# EAGLE design xio (EAGLE 9.5.0)

## Sheet 1 of 12: Block diagram
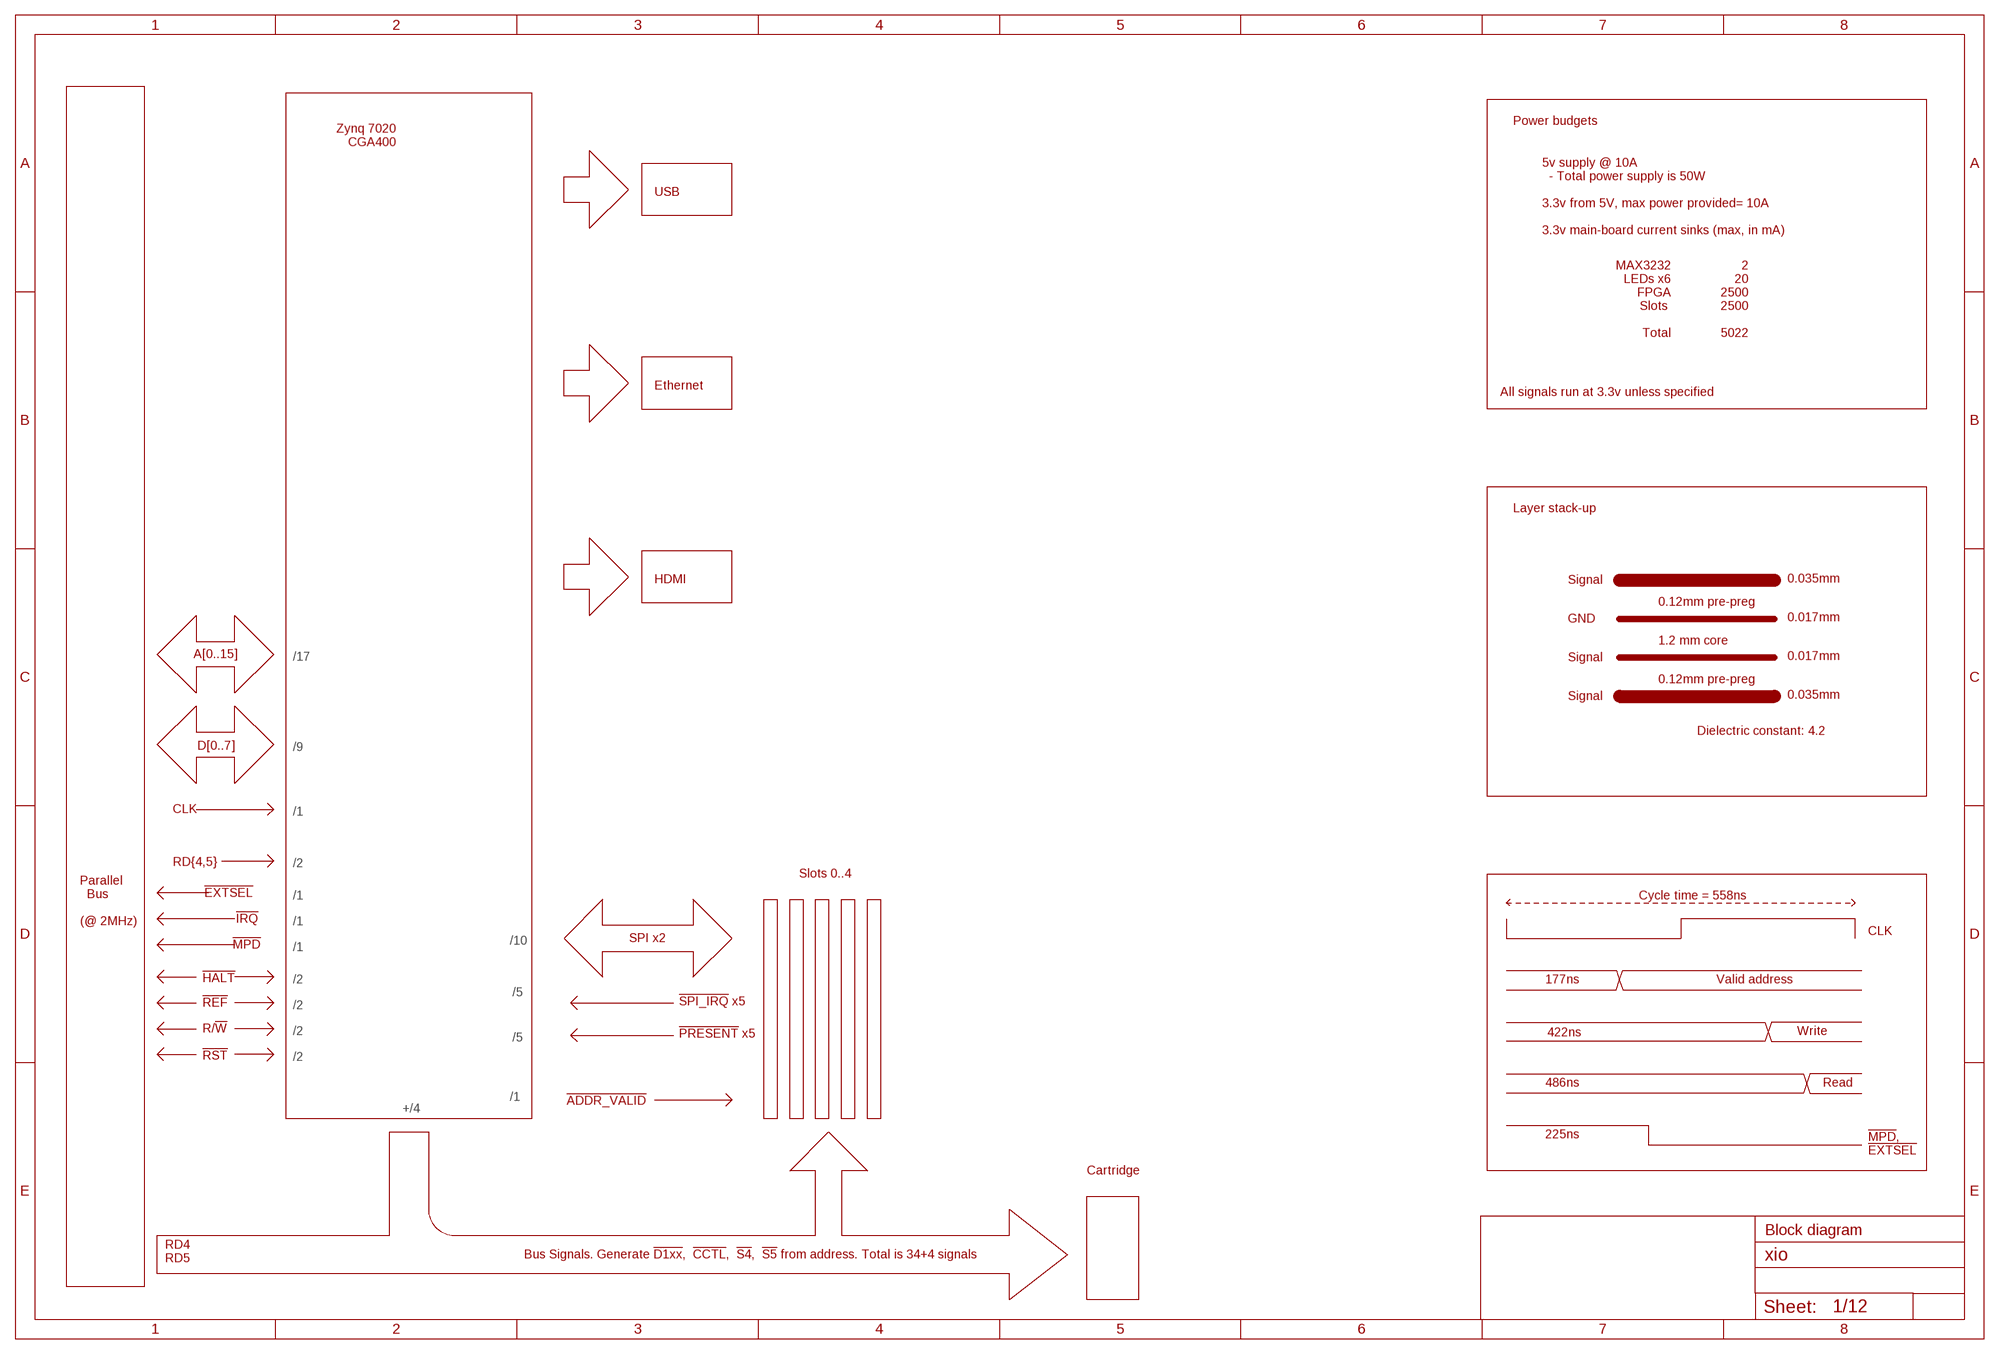
[diagram p0: schematic, sheet 1]

### Notes on the sheet
- Zynq 7020
   CGA400
- Power budgets
- USB
- 5v supply @ 10A
    - Total power supply is 50W
  
  3.3v from 5V, max power provided= 10A 
  
  3.3v main-board current sinks (max, in mA)
- MAX3232
  LEDs x6
  FPGA
  Slots 
  
  Total
- 2
  20
  2500
  2500
  
  5022
- Ethernet
- All signals run at 3.3v unless specified
- Layer stack-up
- HDMI | Signal | 0.035mm
- 0.12mm pre-preg
- GND | 0.017mm
- 1.2 mm core
- A[0..15] | /17 | Signal | 0.017mm
- 0.12mm pre-preg
- Signal | 0.035mm
- Dielectric constant: 4.2
- D[0..7] | /9
- CLK | /1
- RD{4,5} | /2
- Slots 0..4
- !EXTSEL!
- /1 | Cycle time = 558ns
- !IRQ!
- Parallel
    Bus
  
  (@ 2MHz)
- /1
- CLK
- !MPD! | SPI x2
- /10
- /1
- !HALT! | /2 | 177ns | Valid address
- /5
- !REF! | !SPI_IRQ! x5
- /2
- R/!W! | /2 | Write
- !PRESENT! x5 | 422ns
- /5
- !RST! | /2
- 486ns | Read
- /1
- !ADDR_VALID!
- +/4
- 225ns
- !MPD!,
  !EXTSEL!
- Cartridge
- Block diagram
- Bus Signals. Generate !D1xx!,  !CCTL!,  !S4!,  !S5! from address. Total is 34+4 signals
- RD4
  RD5

## Sheet 2 of 12: High voltage signalling
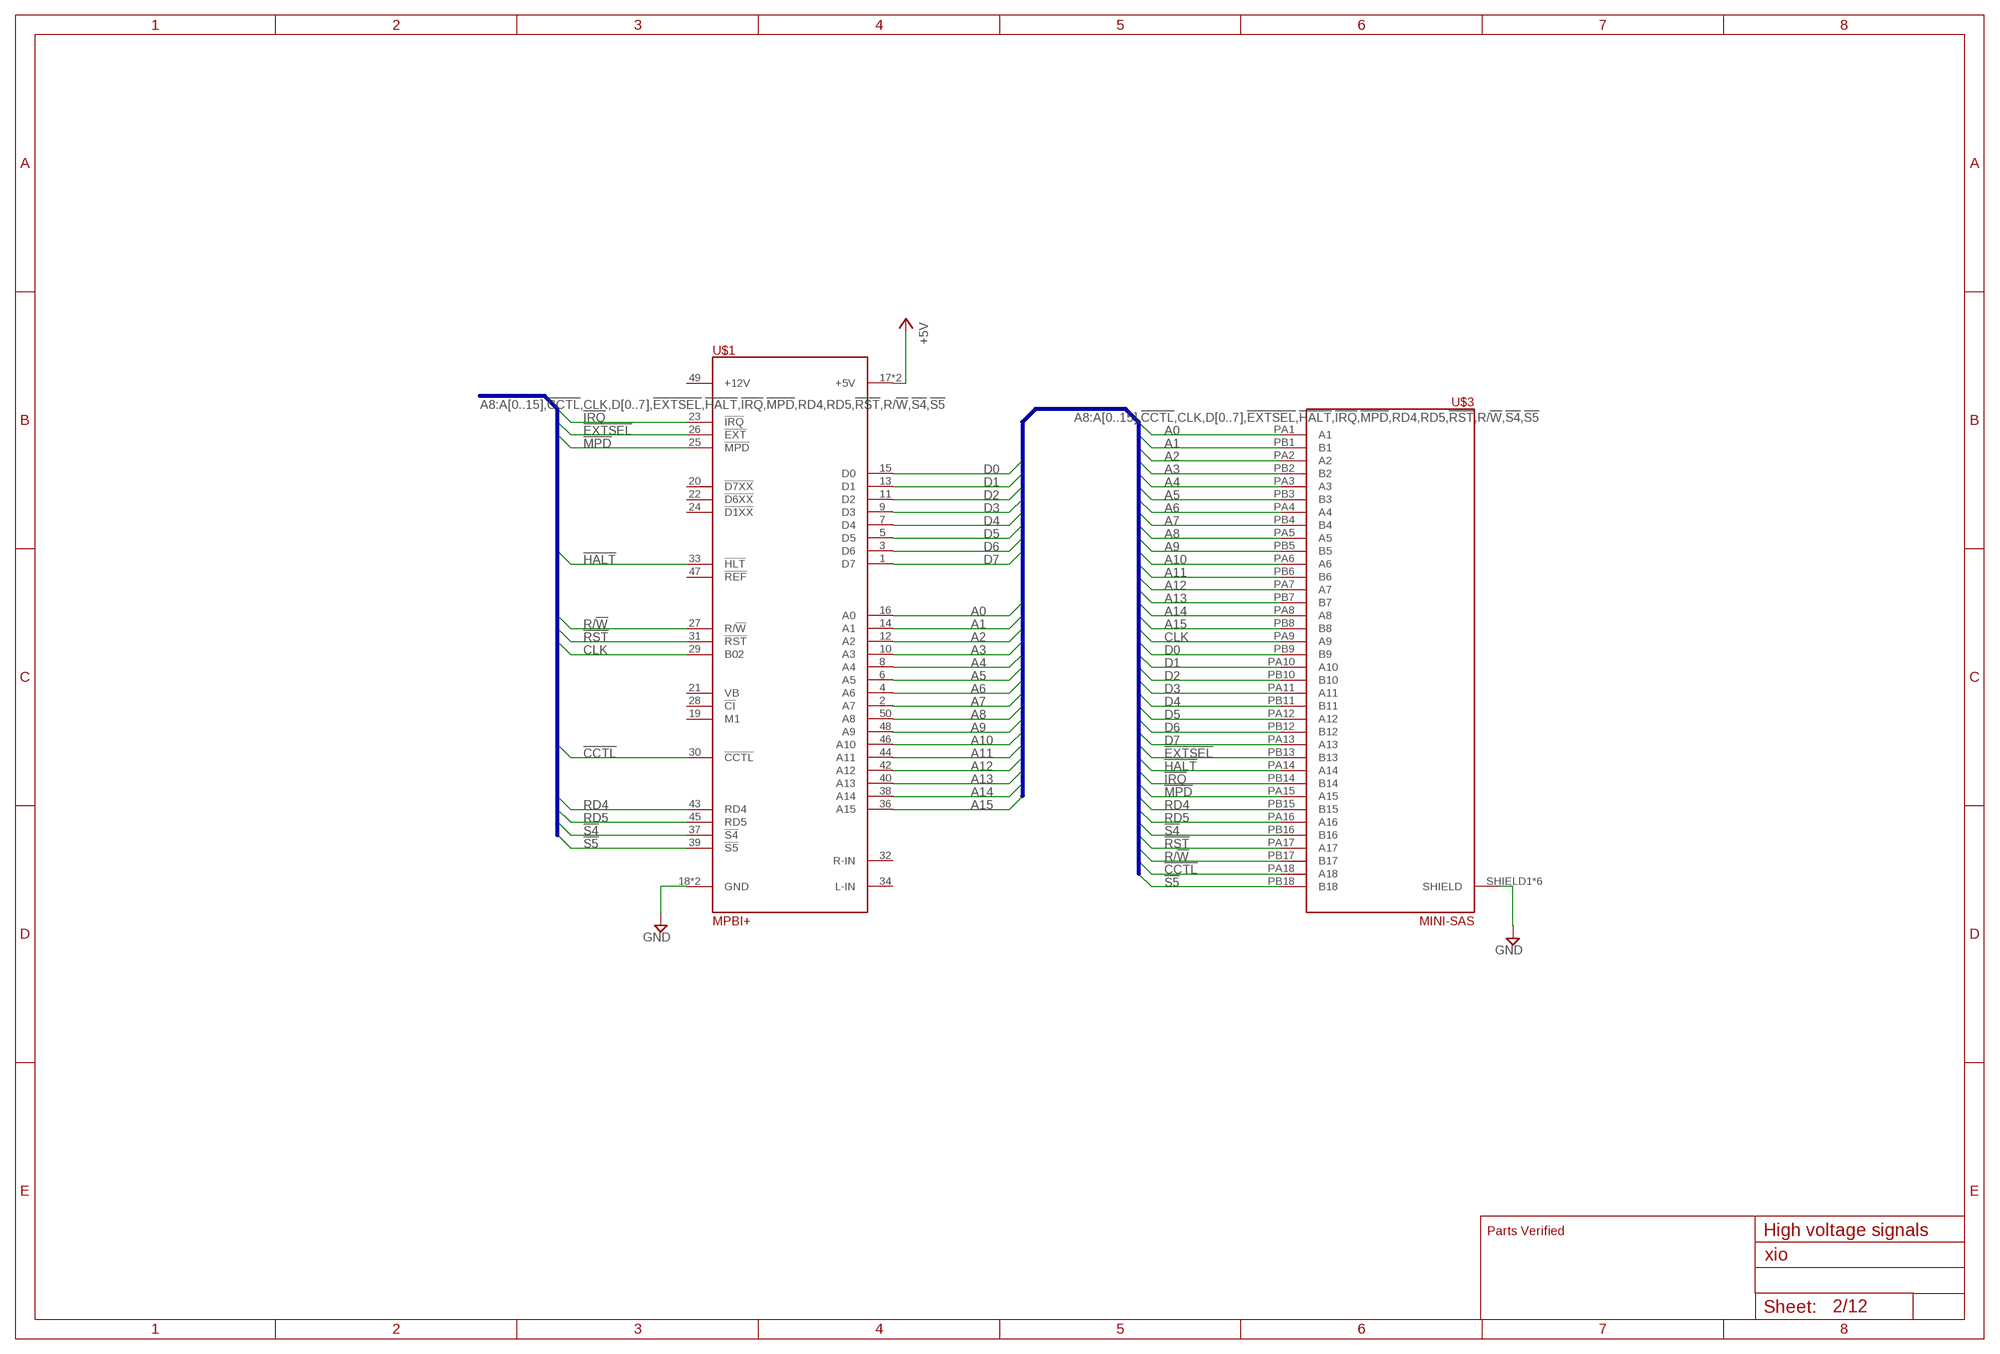
[diagram p1: schematic, sheet 2]

### Parts
U$1  MPBI+  [2X25]
U$3  MINI-SAS  [MINI-SAS]

### Nets
!CCTL!: U$1.30(!CCTL!) U$3.PA18(A18)
!EXTSEL!: U$1.26(!EXT!) U$3.PB13(B13)
!HALT!: U$1.33(!HLT!) U$3.PA14(A14)
!IRQ!: U$1.23(!IRQ!) U$3.PB14(B14)
!MPD!: U$1.25(!MPD!) U$3.PA15(A15)
!RST!: U$1.31(!RST!) U$3.PA17(A17)
!S4!: U$1.37(!S4!) U$3.PB16(B16)
!S5!: U$1.39(!S5!) U$3.PB18(B18)
+5V [Power]: U$1.17(+5V) U$1.41(+5V) ; also sheet 3,4,5
A0: U$1.16(A0) U$3.PA1(A1) ; also sheet 3,4,5
A1: U$1.14(A1) U$3.PB1(B1) ; also sheet 3,4,5
A2: U$1.12(A2) U$3.PA2(A2) ; also sheet 3,4,5
A3: U$1.10(A3) U$3.PB2(B2) ; also sheet 3,4,5
A4: U$1.8(A4) U$3.PA3(A3) ; also sheet 3,4,5
A5: U$1.6(A5) U$3.PB3(B3) ; also sheet 3,4,5
A6: U$1.4(A6) U$3.PA4(A4) ; also sheet 3,4,5
A7: U$1.2(A7) U$3.PB4(B4) ; also sheet 3,4,5
A8: U$1.50(A8) U$3.PA5(A5) ; also sheet 3,4,5
A9: U$1.48(A9) U$3.PB5(B5) ; also sheet 3,4,5
A10: U$1.46(A10) U$3.PA6(A6) ; also sheet 3,4,5
A11: U$1.44(A11) U$3.PB6(B6) ; also sheet 3,4,5
A12: U$1.42(A12) U$3.PA7(A7) ; also sheet 3,4,5
A13: U$1.40(A13) U$3.PB7(B7) ; also sheet 3,4,5
A14: U$1.38(A14) U$3.PA8(A8) ; also sheet 3,4,5
A15: U$1.36(A15) U$3.PB8(B8) ; also sheet 3,4,5
CLK: U$1.29(B02) U$3.PA9(A9)
D0: U$1.15(D0) U$3.PB9(B9) ; also sheet 3,4,5
D1: U$1.13(D1) U$3.PA10(A10) ; also sheet 3,4,5
D2: U$1.11(D2) U$3.PB10(B10) ; also sheet 3,4,5
D3: U$1.9(D3) U$3.PA11(A11) ; also sheet 3,4,5
D4: U$1.7(D4) U$3.PB11(B11) ; also sheet 3,4,5
D5: U$1.5(D5) U$3.PA12(A12) ; also sheet 3,4,5
D6: U$1.3(D6) U$3.PB12(B12) ; also sheet 3,4,5
D7: U$1.1(D7) U$3.PA13(A13) ; also sheet 3,4,5
GND: U$1.18(GND) U$1.35(GND) U$3.SHIELD1(SHIELD) U$3.SHIELD2(SHIELD) U$3.SHIELD3(SHIELD) U$3.SHIELD4(SHIELD) U$3.SHIELD5(SHIELD) U$3.SHIELD6(SHIELD) ; also sheet 3,4,5
R/!W!: U$1.27(R/!W!) U$3.PB17(B17)
RD4: U$1.43(RD4) U$3.PB15(B15)
RD5: U$1.45(RD5) U$3.PA16(A16)
Unconnected: U$1.19(M1) U$1.20(!D7XX!) U$1.21(VB) U$1.22(!D6XX!) U$1.24(!D1XX!) U$1.28(!CI!) U$1.32(R-IN) U$1.34(L-IN) U$1.47(!REF!) U$1.49(+12V)

### Buses
A8:A[0..15],!CCTL!,CLK,D[0..7],!EXTSEL!,!HALT!,!IRQ!,!MPD!,RD4,RD5,!RST!,R/!W!,!S4!,!S5!

### Notes on the sheet
- Parts Verified | High voltage signals

## Sheet 3 of 12: Expansion slots 0 & 1
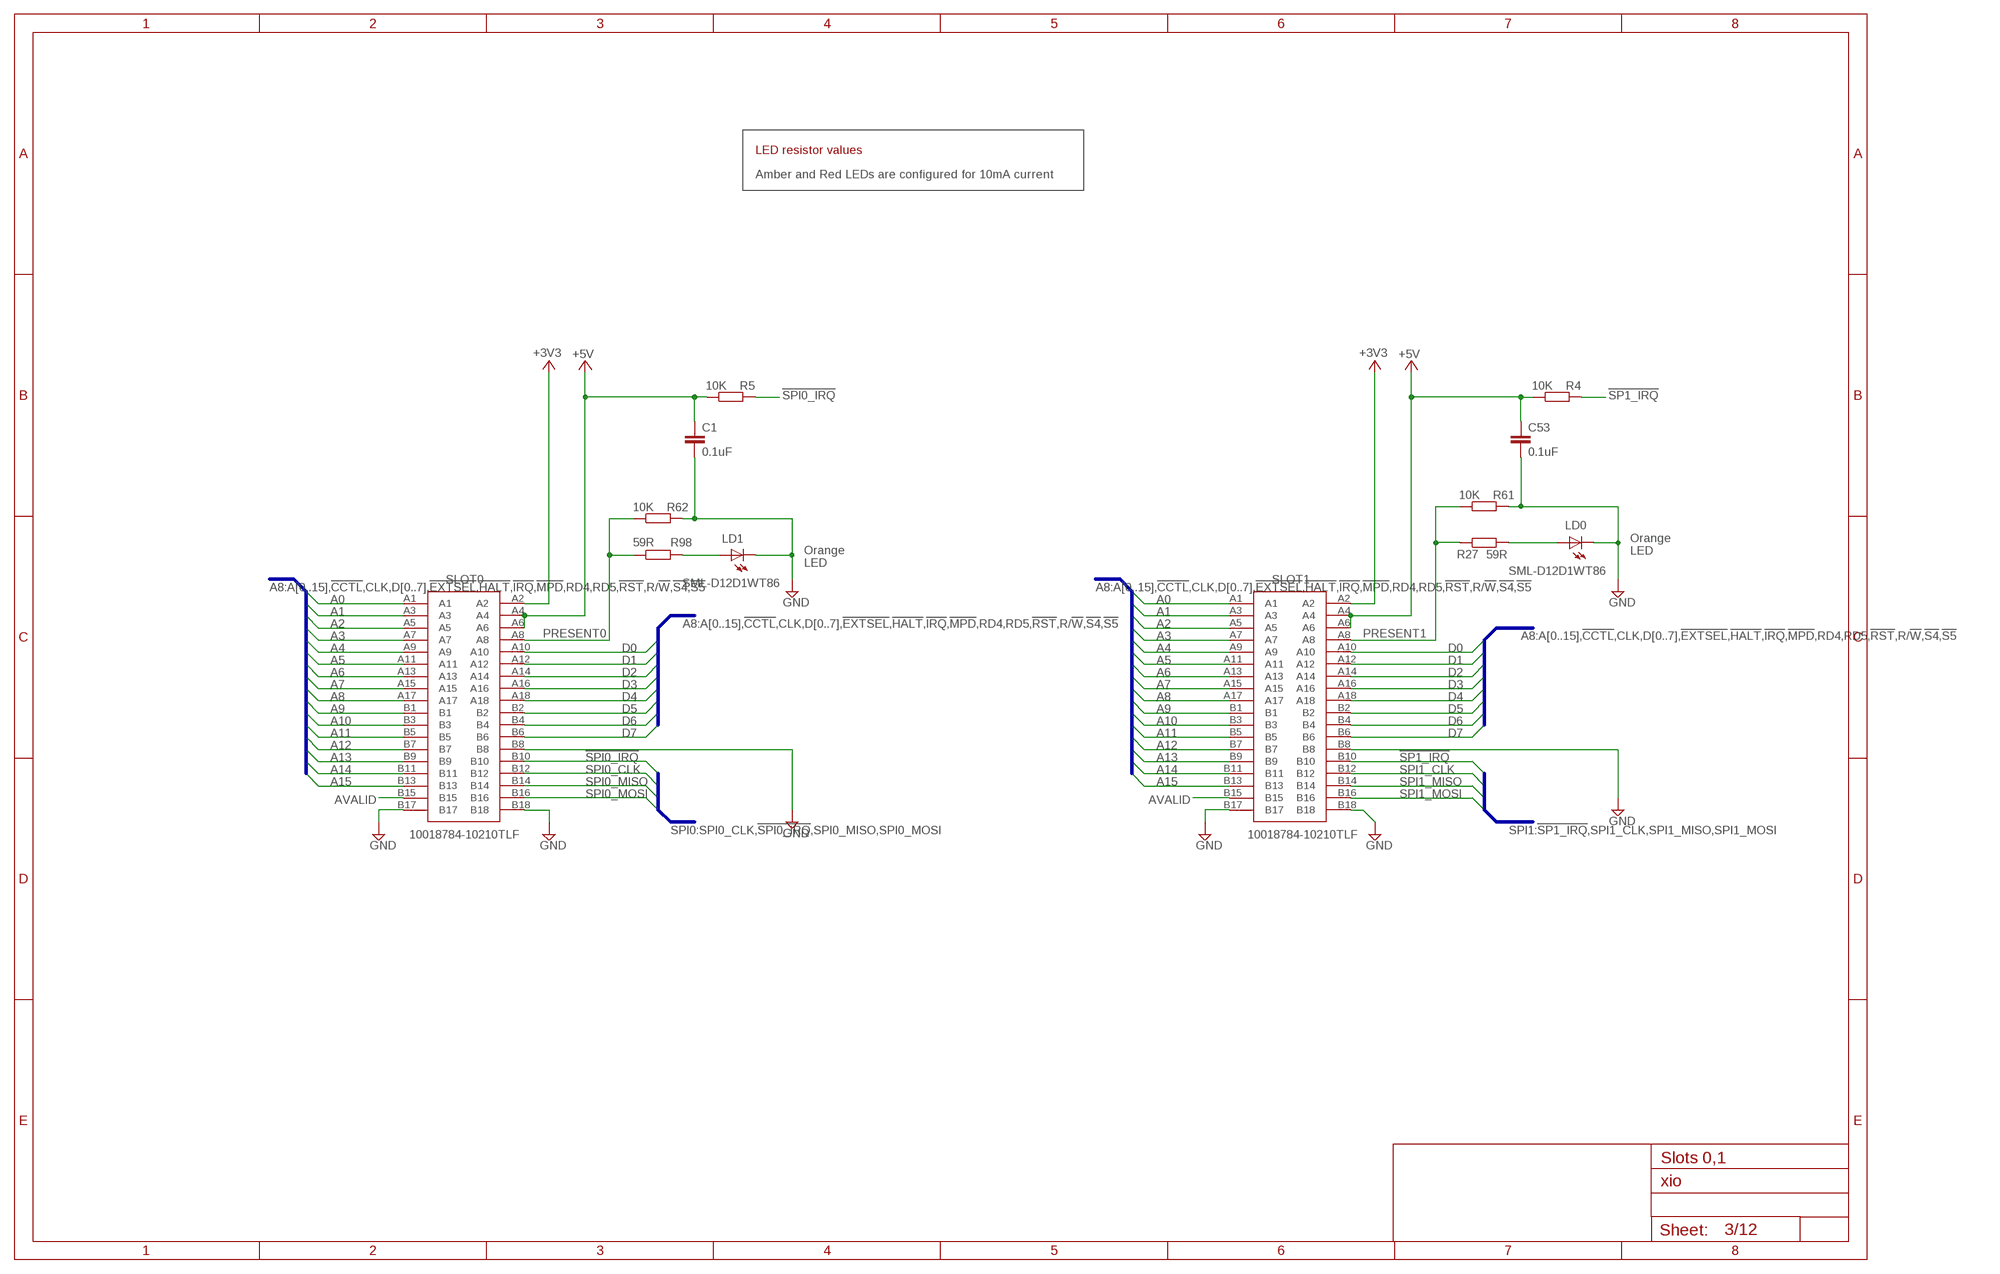
[diagram p2: schematic, sheet 3]

### Parts
C1  0.1uF  C-EUC0201  [C0201]
C53  0.1uF  C-EUC0201  [C0201]
LD0  SML-D12D1WT86  LEDCHIPLED_0603  [CHIPLED_0603]
LD1  SML-D12D1WT86  LEDCHIPLED_0603  [CHIPLED_0603]
R4  10K  R-EU_R0201  [R0201]
R5  10K  R-EU_R0201  [R0201]
R27  59R  R-EU_R0402  [R0402]
R61  10K  R-EU_R0201  [R0201]
R62  10K  R-EU_R0201  [R0201]
R98  59R  R-EU_R0402  [R0402]
SLOT0  10018784-10210TLF  [1001878410210TLF]
SLOT1  10018784-10210TLF  [1001878410210TLF]

### Nets
!SP1_IRQ!: R4.2 SLOT1.B10
!SPI0_IRQ!: R5.2 SLOT0.B10
+3V3 [lcd]: SLOT0.A2 SLOT1.A2 ; also sheet 4,5
+5V [Power]: C1.1 C53.1 R4.1 R5.1 SLOT0.A4 SLOT0.A6 SLOT1.A4 SLOT1.A6 ; also sheet 2,4,5
A0: SLOT0.A1 SLOT1.A1 ; also sheet 2,4,5
A1: SLOT0.A3 SLOT1.A3 ; also sheet 2,4,5
A2: SLOT0.A5 SLOT1.A5 ; also sheet 2,4,5
A3: SLOT0.A7 SLOT1.A7 ; also sheet 2,4,5
A4: SLOT0.A9 SLOT1.A9 ; also sheet 2,4,5
A5: SLOT0.A11 SLOT1.A11 ; also sheet 2,4,5
A6: SLOT0.A13 SLOT1.A13 ; also sheet 2,4,5
A7: SLOT0.A15 SLOT1.A15 ; also sheet 2,4,5
A8: SLOT0.A17 SLOT1.A17 ; also sheet 2,4,5
A9: SLOT0.B1 SLOT1.B1 ; also sheet 2,4,5
A10: SLOT0.B3 SLOT1.B3 ; also sheet 2,4,5
A11: SLOT0.B5 SLOT1.B5 ; also sheet 2,4,5
A12: SLOT0.B7 SLOT1.B7 ; also sheet 2,4,5
A13: SLOT0.B9 SLOT1.B9 ; also sheet 2,4,5
A14: SLOT0.B11 SLOT1.B11 ; also sheet 2,4,5
A15: SLOT0.B13 SLOT1.B13 ; also sheet 2,4,5
AVALID: SLOT0.B15 SLOT1.B15 ; also sheet 4,5
D0: SLOT0.A10 SLOT1.A10 ; also sheet 2,4,5
D1: SLOT0.A12 SLOT1.A12 ; also sheet 2,4,5
D2: SLOT0.A14 SLOT1.A14 ; also sheet 2,4,5
D3: SLOT0.A16 SLOT1.A16 ; also sheet 2,4,5
D4: SLOT0.A18 SLOT1.A18 ; also sheet 2,4,5
D5: SLOT0.B2 SLOT1.B2 ; also sheet 2,4,5
D6: SLOT0.B4 SLOT1.B4 ; also sheet 2,4,5
D7: SLOT0.B6 SLOT1.B6 ; also sheet 2,4,5
GND: C1.2 C53.2 LD0.C LD1.C R61.2 R62.2 SLOT0.B8 SLOT0.B17 SLOT0.B18 SLOT1.B8 SLOT1.B17 SLOT1.B18 ; also sheet 2,4,5
N$3: LD1.A R98.2
N$5: LD0.A R27.2
PRESENT0: R62.1 R98.1 SLOT0.A8
PRESENT1: R27.1 R61.1 SLOT1.A8
SPI0_CLK: SLOT0.B12
SPI0_MISO: SLOT0.B14
SPI0_MOSI: SLOT0.B16
SPI1_CLK: SLOT1.B12
SPI1_MISO: SLOT1.B14
SPI1_MOSI: SLOT1.B16

### Buses
A8:A[0..15],!CCTL!,CLK,D[0..7],!EXTSEL!,!HALT!,!IRQ!,!MPD!,RD4,RD5,!RST!,R/!W!,!S4!,!S5!
SPI1:!SP1_IRQ!,SPI1_CLK,SPI1_MISO,SPI1_MOSI
SPI0:SPI0_CLK,!SPI0_IRQ!,SPI0_MISO,SPI0_MOSI

### Notes on the sheet
- LED resistor values
- Amber and Red LEDs are configured for 10mA current
- Orange
  LED
- Orange
  LED
- Slots 0,1

## Sheet 4 of 12: Expansion slots 2 & 3
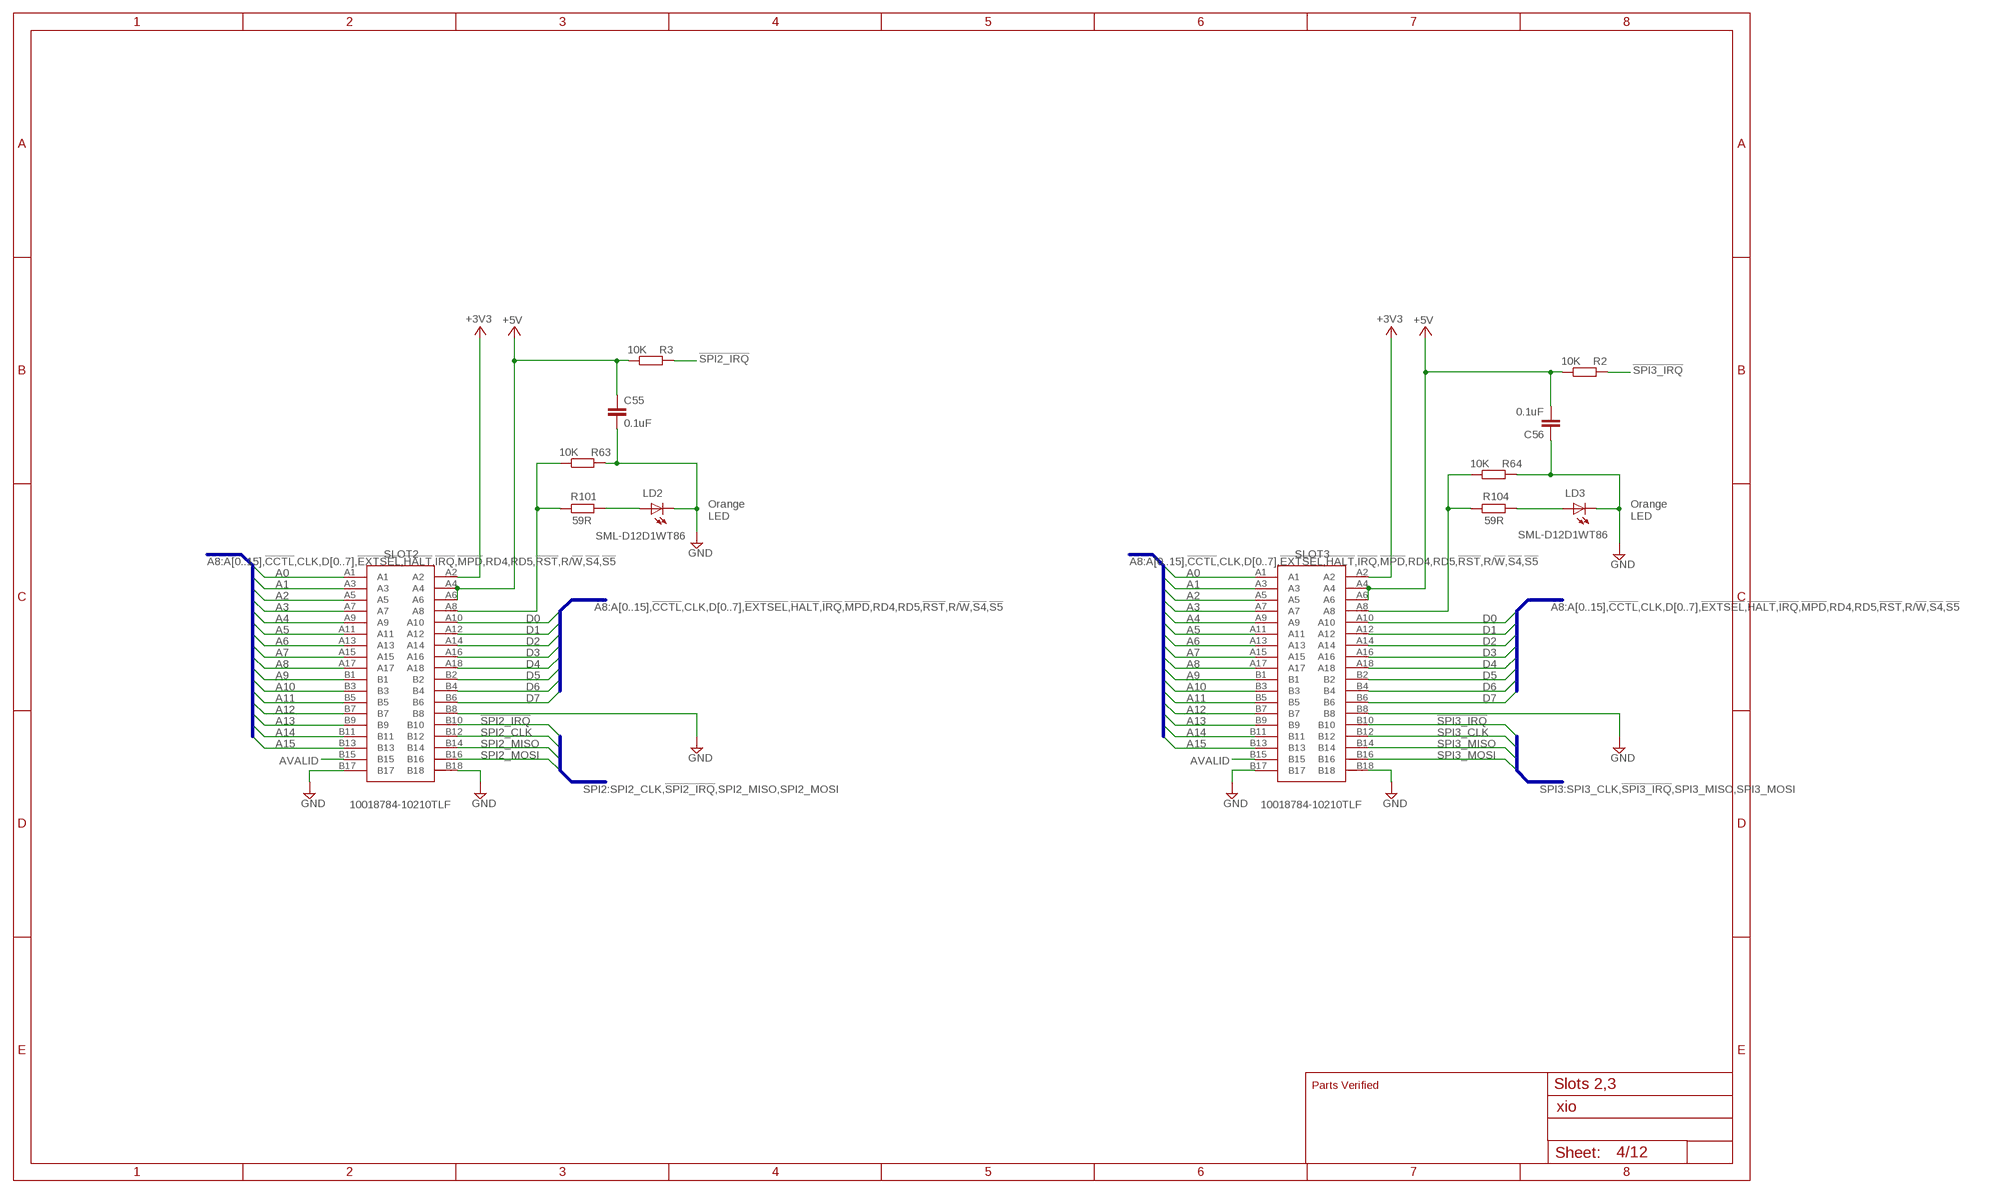
[diagram p3: schematic, sheet 4]

### Parts
C55  0.1uF  C-EUC0201  [C0201]
C56  0.1uF  C-EUC0201  [C0201]
LD2  SML-D12D1WT86  LEDCHIPLED_0603  [CHIPLED_0603]
LD3  SML-D12D1WT86  LEDCHIPLED_0603  [CHIPLED_0603]
R2  10K  R-EU_R0201  [R0201]
R3  10K  R-EU_R0201  [R0201]
R63  10K  R-EU_R0201  [R0201]
R64  10K  R-EU_R0201  [R0201]
R101  59R  R-EU_R0402  [R0402]
R104  59R  R-EU_R0402  [R0402]
SLOT2  10018784-10210TLF  [1001878410210TLF]
SLOT3  10018784-10210TLF  [1001878410210TLF]

### Nets
!SPI2_IRQ!: R3.2 SLOT2.B10
!SPI3_IRQ!: R2.2 SLOT3.B10
+3V3 [lcd]: SLOT2.A2 SLOT3.A2 ; also sheet 3,5
+5V [Power]: C55.1 C56.2 R2.1 R3.1 SLOT2.A4 SLOT2.A6 SLOT3.A4 SLOT3.A6 ; also sheet 2,3,5
A0: SLOT2.A1 SLOT3.A1 ; also sheet 2,3,5
A1: SLOT2.A3 SLOT3.A3 ; also sheet 2,3,5
A2: SLOT2.A5 SLOT3.A5 ; also sheet 2,3,5
A3: SLOT2.A7 SLOT3.A7 ; also sheet 2,3,5
A4: SLOT2.A9 SLOT3.A9 ; also sheet 2,3,5
A5: SLOT2.A11 SLOT3.A11 ; also sheet 2,3,5
A6: SLOT2.A13 SLOT3.A13 ; also sheet 2,3,5
A7: SLOT2.A15 SLOT3.A15 ; also sheet 2,3,5
A8: SLOT2.A17 SLOT3.A17 ; also sheet 2,3,5
A9: SLOT2.B1 SLOT3.B1 ; also sheet 2,3,5
A10: SLOT2.B3 SLOT3.B3 ; also sheet 2,3,5
A11: SLOT2.B5 SLOT3.B5 ; also sheet 2,3,5
A12: SLOT2.B7 SLOT3.B7 ; also sheet 2,3,5
A13: SLOT2.B9 SLOT3.B9 ; also sheet 2,3,5
A14: SLOT2.B11 SLOT3.B11 ; also sheet 2,3,5
A15: SLOT2.B13 SLOT3.B13 ; also sheet 2,3,5
AVALID: SLOT2.B15 SLOT3.B15 ; also sheet 3,5
D0: SLOT2.A10 SLOT3.A10 ; also sheet 2,3,5
D1: SLOT2.A12 SLOT3.A12 ; also sheet 2,3,5
D2: SLOT2.A14 SLOT3.A14 ; also sheet 2,3,5
D3: SLOT2.A16 SLOT3.A16 ; also sheet 2,3,5
D4: SLOT2.A18 SLOT3.A18 ; also sheet 2,3,5
D5: SLOT2.B2 SLOT3.B2 ; also sheet 2,3,5
D6: SLOT2.B4 SLOT3.B4 ; also sheet 2,3,5
D7: SLOT2.B6 SLOT3.B6 ; also sheet 2,3,5
GND: C55.2 C56.1 LD2.C LD3.C R63.2 R64.2 SLOT2.B8 SLOT2.B17 SLOT2.B18 SLOT3.B8 SLOT3.B17 SLOT3.B18 ; also sheet 2,3,5
N$1: LD2.A R101.2
N$6: R64.1 R104.1 SLOT3.A8
N$7: R63.1 R101.1 SLOT2.A8
N$8: LD3.A R104.2
SPI2_CLK: SLOT2.B12
SPI2_MISO: SLOT2.B14
SPI2_MOSI: SLOT2.B16
SPI3_CLK: SLOT3.B12
SPI3_MISO: SLOT3.B14
SPI3_MOSI: SLOT3.B16

### Buses
A8:A[0..15],!CCTL!,CLK,D[0..7],!EXTSEL!,!HALT!,!IRQ!,!MPD!,RD4,RD5,!RST!,R/!W!,!S4!,!S5!
SPI3:SPI3_CLK,!SPI3_IRQ!,SPI3_MISO,SPI3_MOSI
SPI2:SPI2_CLK,!SPI2_IRQ!,SPI2_MISO,SPI2_MOSI

### Notes on the sheet
- Orange
  LED
- Orange
  LED
- Parts Verified | Slots 2,3

## Sheet 5 of 12: Expansion slot 4 and Internal
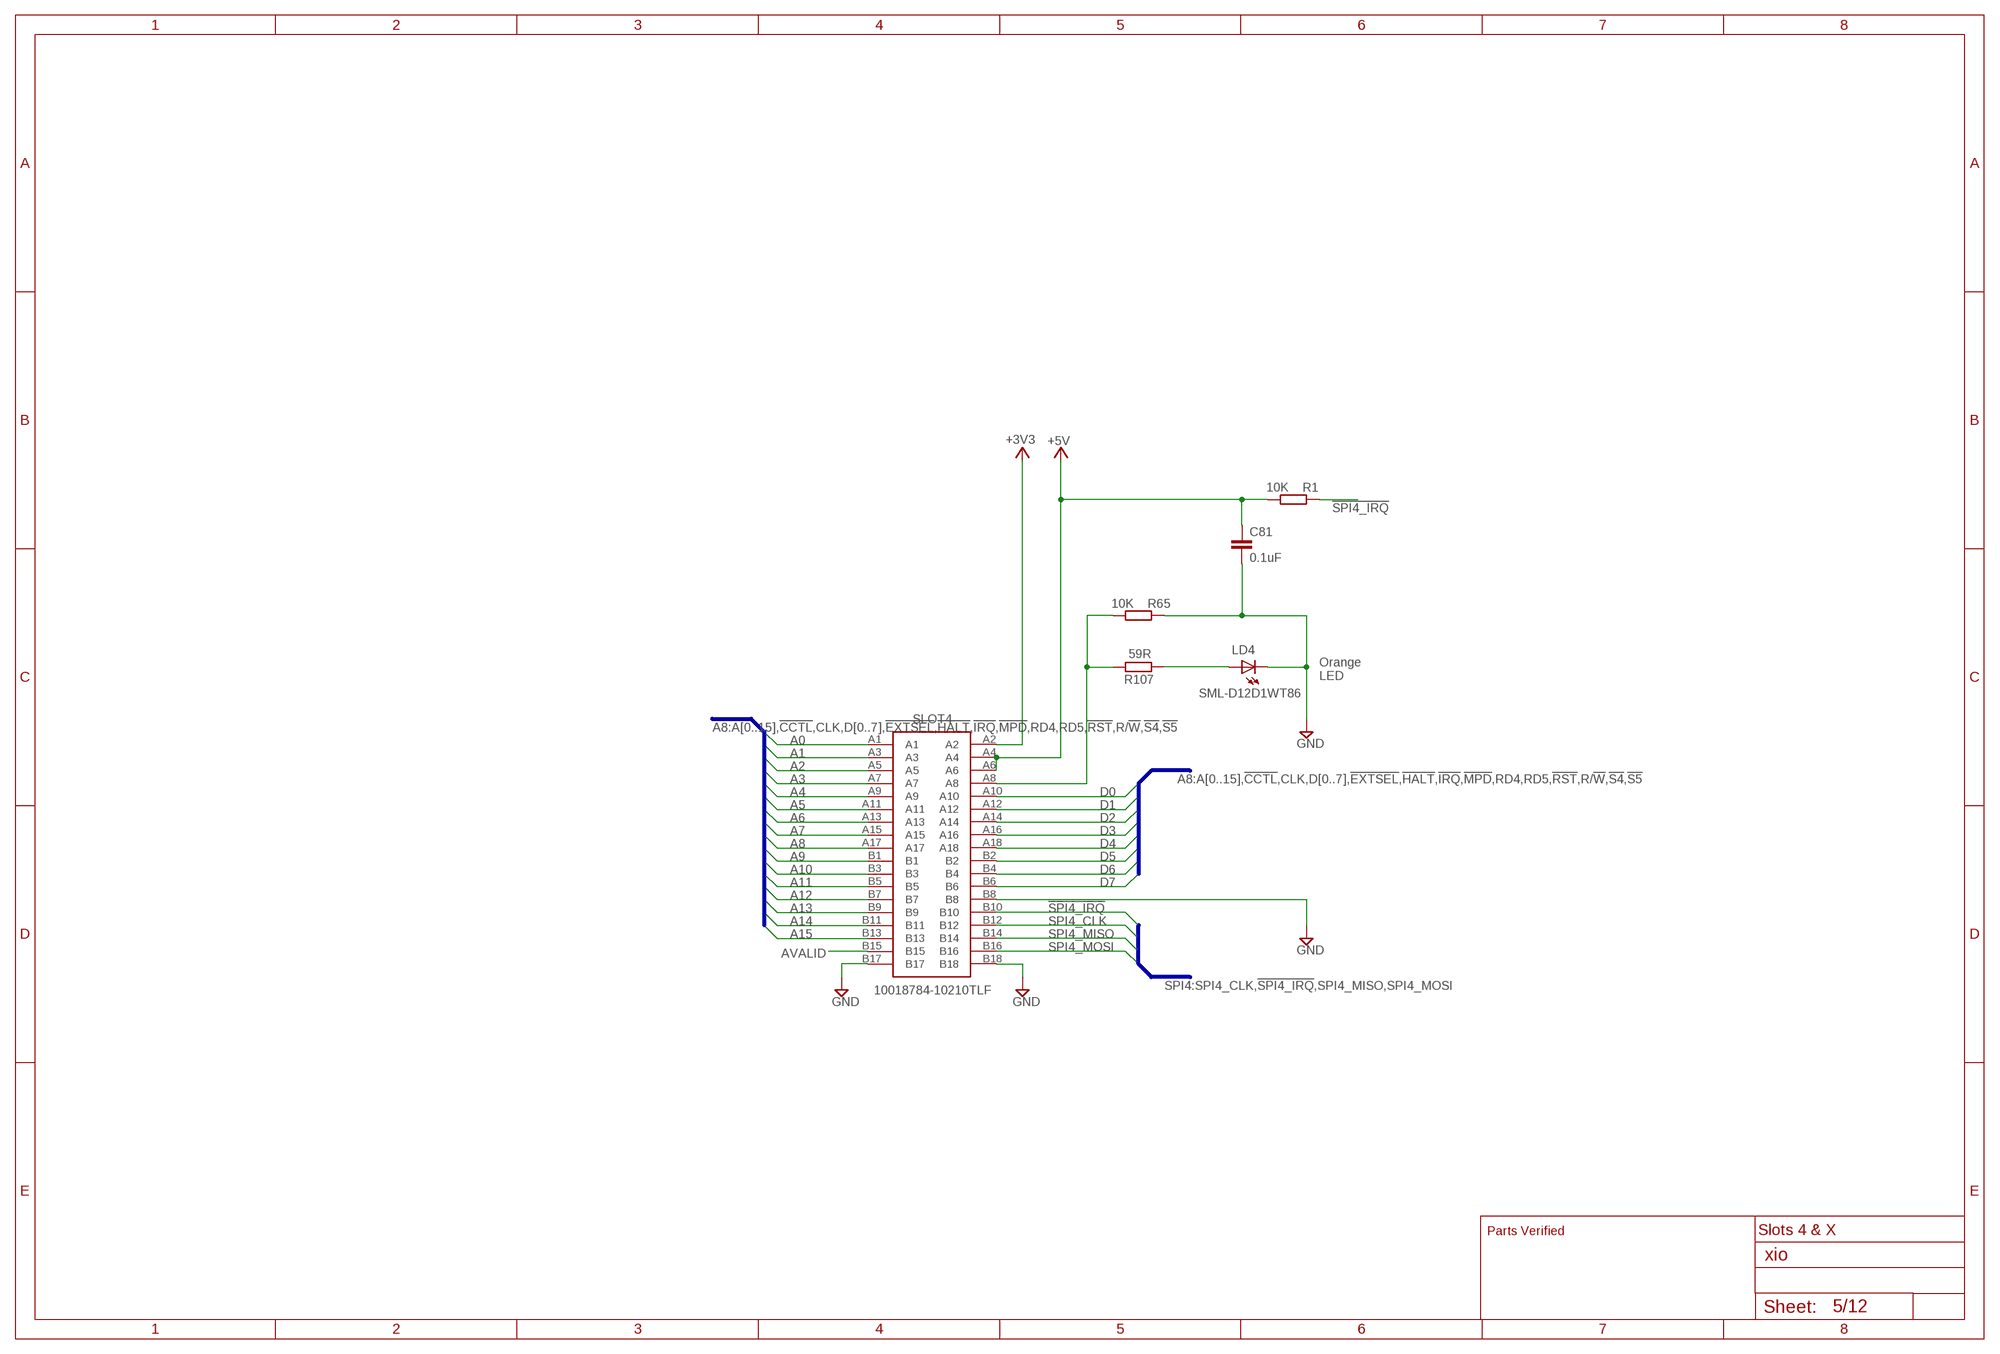
[diagram p4: schematic, sheet 5]

### Parts
C81  0.1uF  C-EUC0201  [C0201]
LD4  SML-D12D1WT86  LEDCHIPLED_0603  [CHIPLED_0603]
R1  10K  R-EU_R0201  [R0201]
R65  10K  R-EU_R0201  [R0201]
R107  59R  R-EU_R0402  [R0402]
SLOT4  10018784-10210TLF  [1001878410210TLF]

### Nets
!SPI4_IRQ!: R1.2 SLOT4.B10
+3V3 [lcd]: SLOT4.A2 ; also sheet 3,4
+5V [Power]: C81.1 R1.1 SLOT4.A4 SLOT4.A6 ; also sheet 2,3,4
A0: SLOT4.A1 ; also sheet 2,3,4
A1: SLOT4.A3 ; also sheet 2,3,4
A2: SLOT4.A5 ; also sheet 2,3,4
A3: SLOT4.A7 ; also sheet 2,3,4
A4: SLOT4.A9 ; also sheet 2,3,4
A5: SLOT4.A11 ; also sheet 2,3,4
A6: SLOT4.A13 ; also sheet 2,3,4
A7: SLOT4.A15 ; also sheet 2,3,4
A8: SLOT4.A17 ; also sheet 2,3,4
A9: SLOT4.B1 ; also sheet 2,3,4
A10: SLOT4.B3 ; also sheet 2,3,4
A11: SLOT4.B5 ; also sheet 2,3,4
A12: SLOT4.B7 ; also sheet 2,3,4
A13: SLOT4.B9 ; also sheet 2,3,4
A14: SLOT4.B11 ; also sheet 2,3,4
A15: SLOT4.B13 ; also sheet 2,3,4
AVALID: SLOT4.B15 ; also sheet 3,4
D0: SLOT4.A10 ; also sheet 2,3,4
D1: SLOT4.A12 ; also sheet 2,3,4
D2: SLOT4.A14 ; also sheet 2,3,4
D3: SLOT4.A16 ; also sheet 2,3,4
D4: SLOT4.A18 ; also sheet 2,3,4
D5: SLOT4.B2 ; also sheet 2,3,4
D6: SLOT4.B4 ; also sheet 2,3,4
D7: SLOT4.B6 ; also sheet 2,3,4
GND: C81.2 LD4.C R65.2 SLOT4.B8 SLOT4.B17 SLOT4.B18 ; also sheet 2,3,4
N$9: R65.1 R107.1 SLOT4.A8
N$10: LD4.A R107.2
SPI4_CLK: SLOT4.B12
SPI4_MISO: SLOT4.B14
SPI4_MOSI: SLOT4.B16

### Buses
A8:A[0..15],!CCTL!,CLK,D[0..7],!EXTSEL!,!HALT!,!IRQ!,!MPD!,RD4,RD5,!RST!,R/!W!,!S4!,!S5!
SPI4:SPI4_CLK,!SPI4_IRQ!,SPI4_MISO,SPI4_MOSI

### Notes on the sheet
- Orange
  LED
- Parts Verified | Slots 4 & X

## Sheet 6 of 12
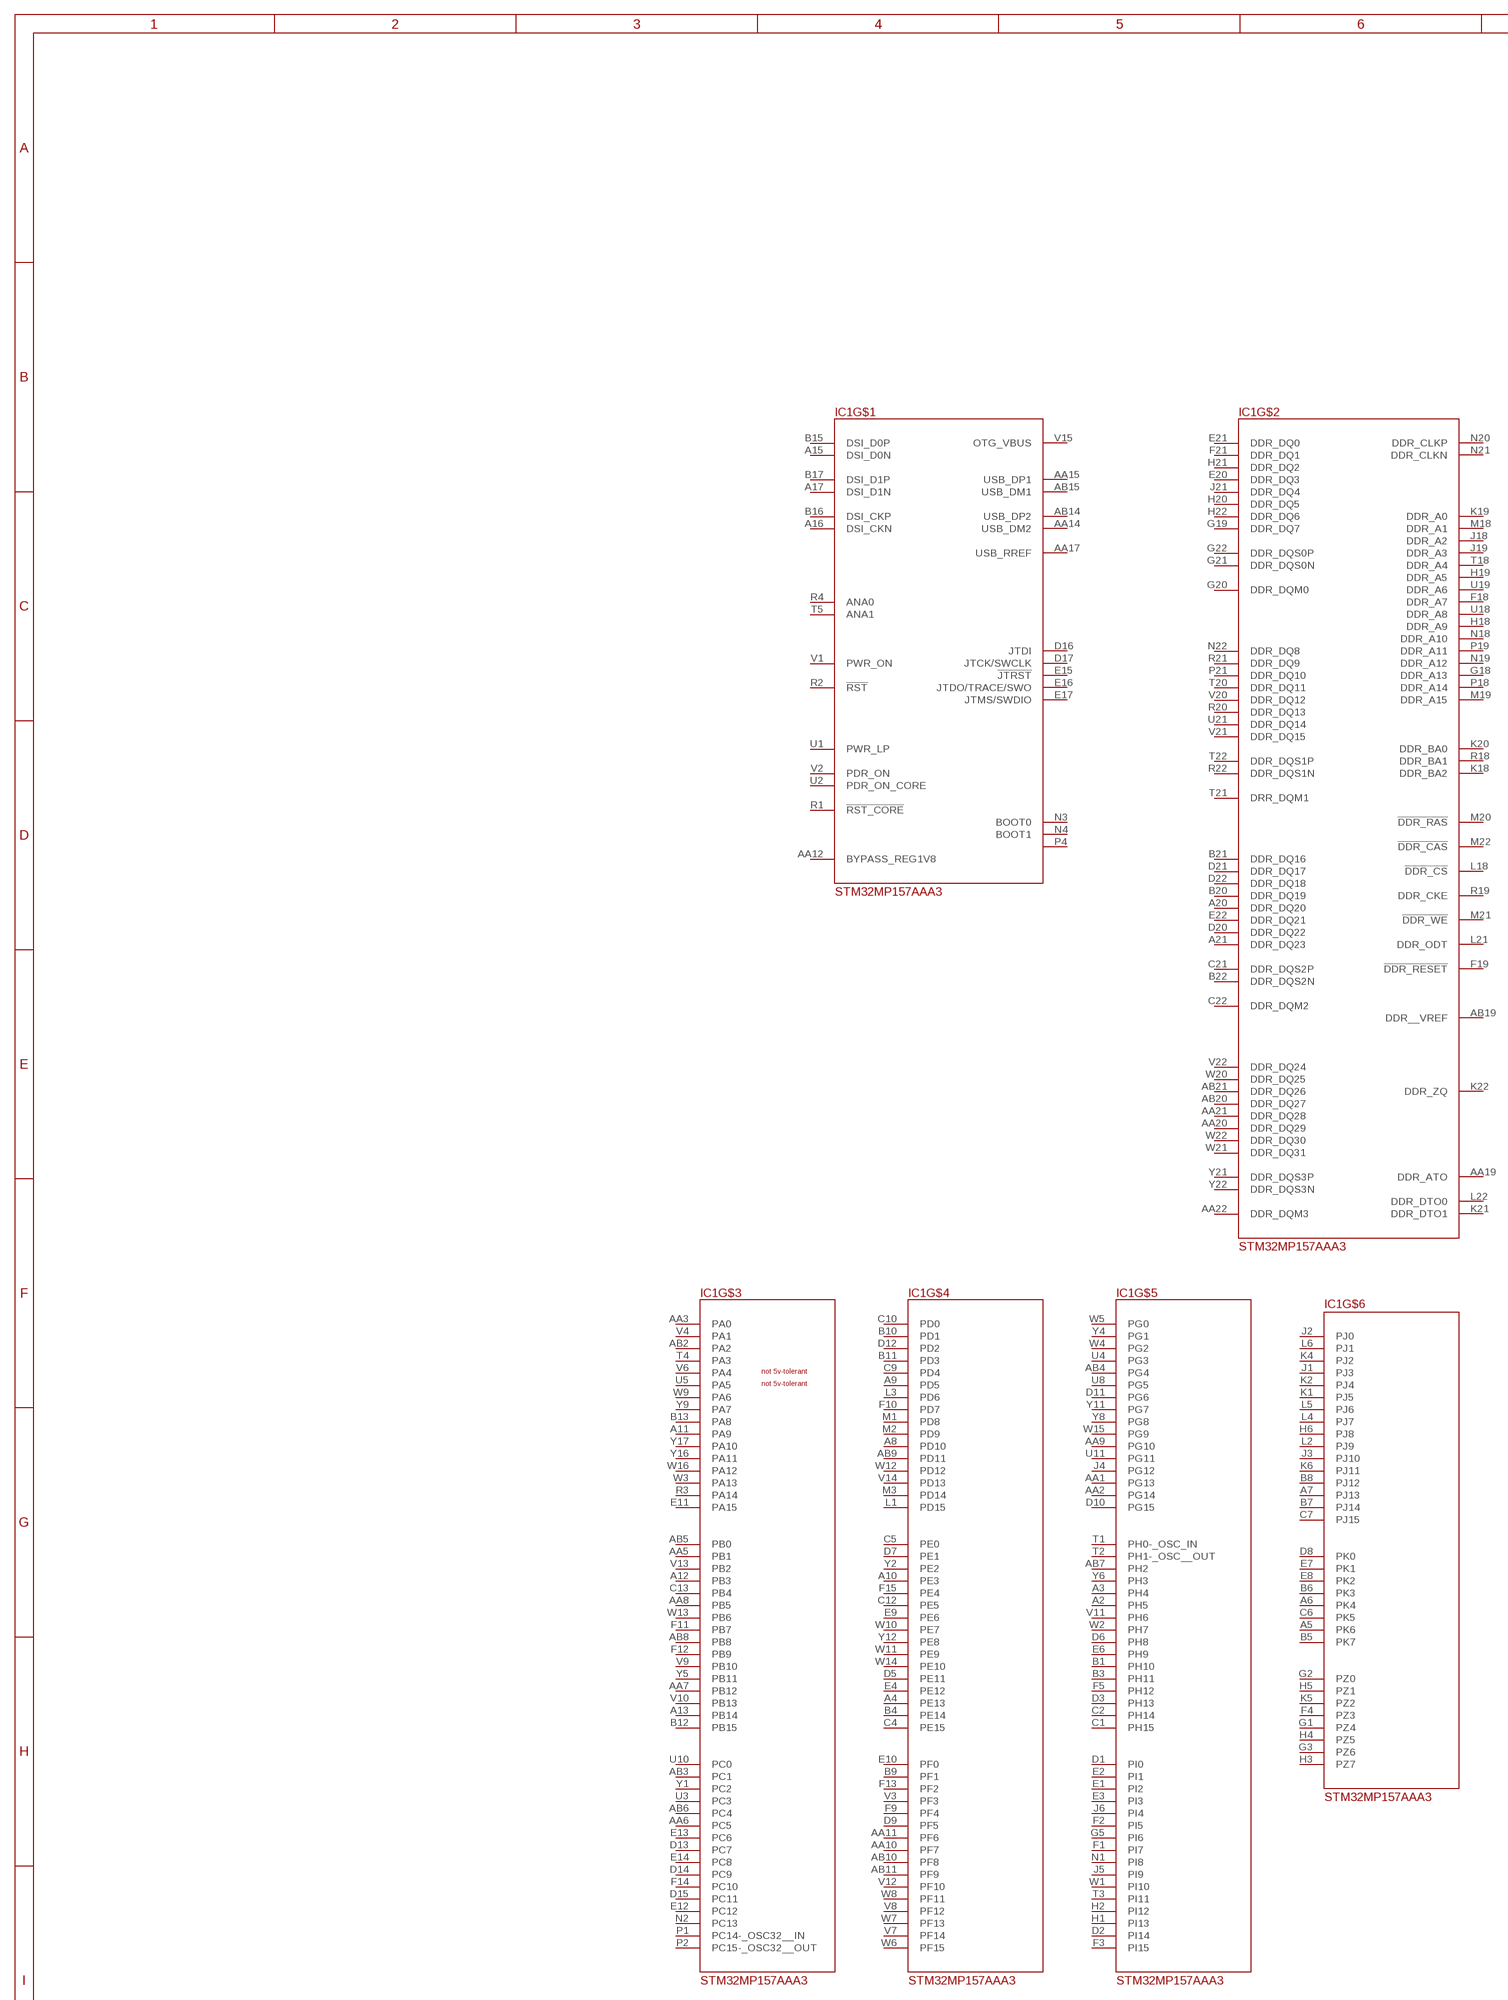
[diagram p5: schematic, sheet 6, part 1 of 2]
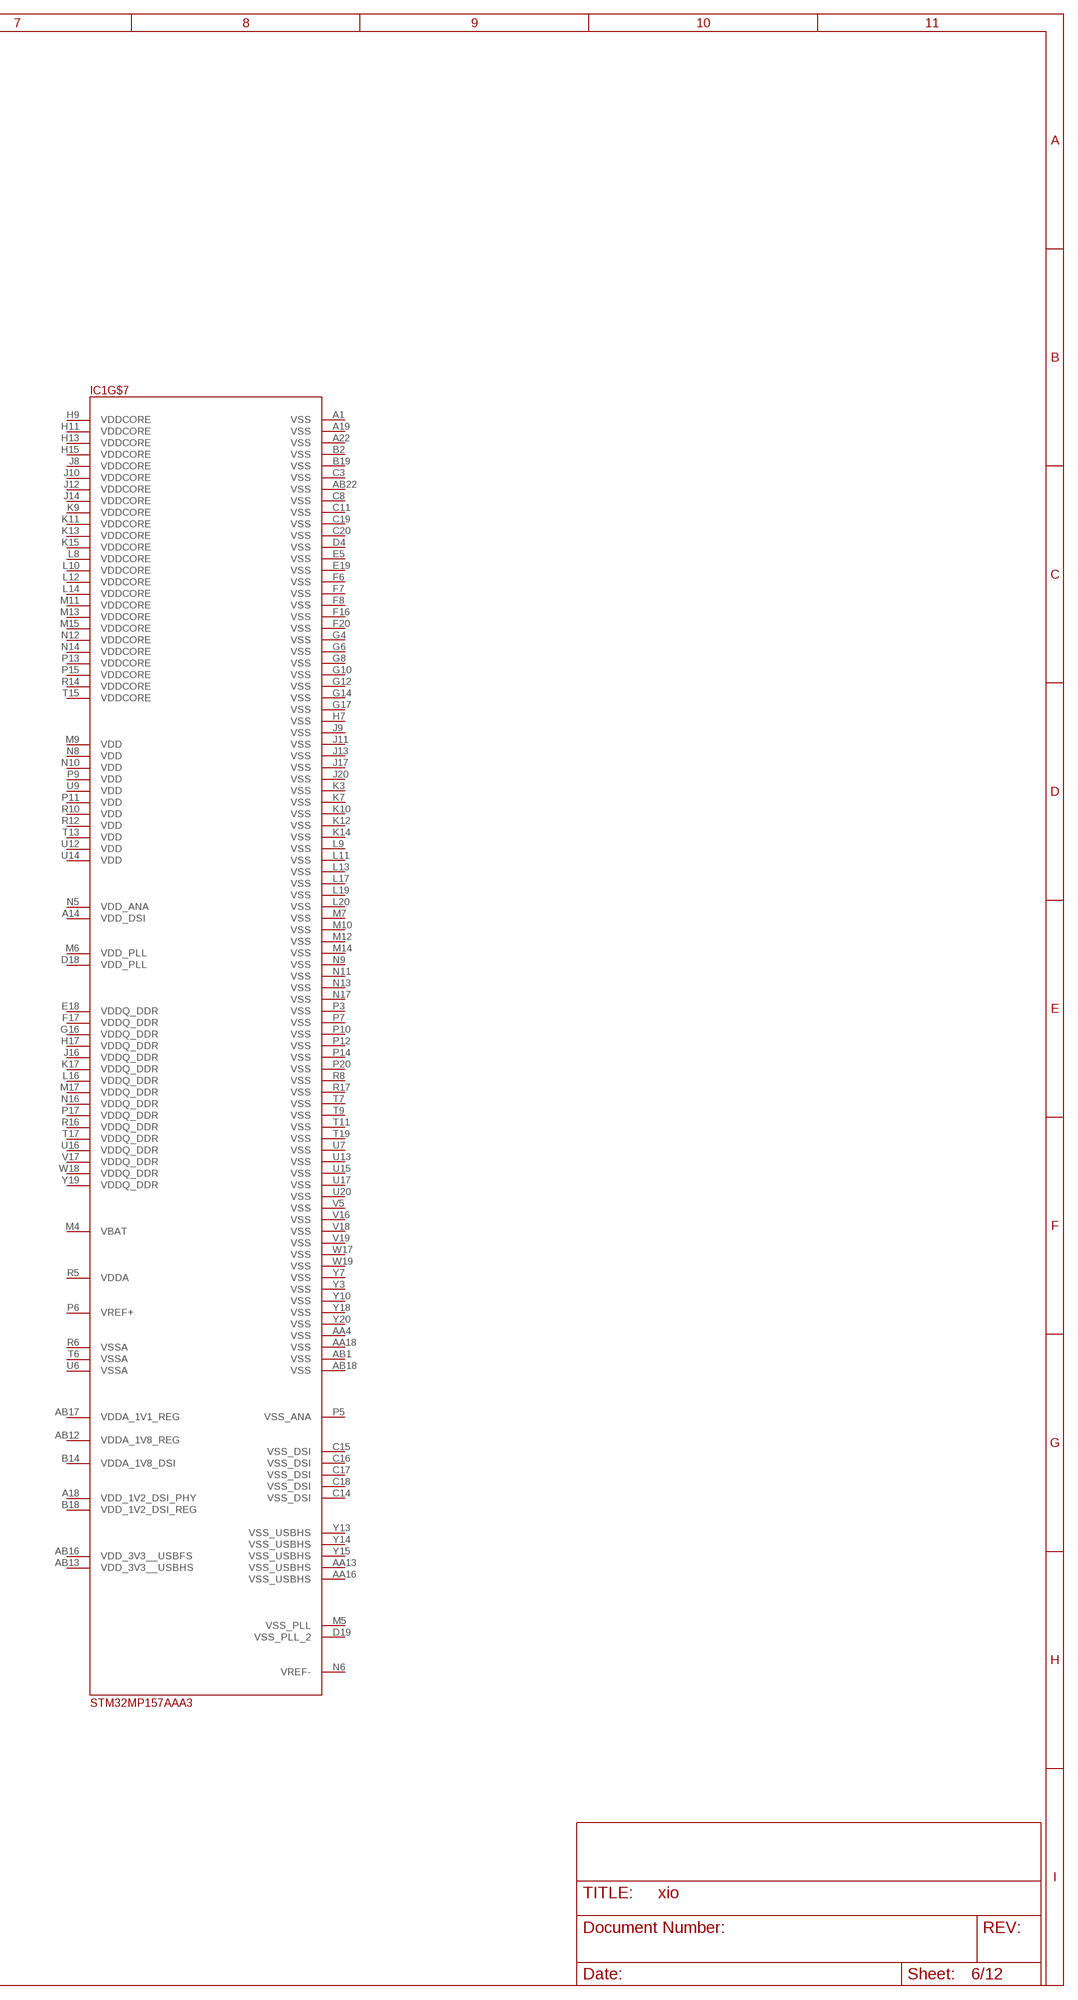
[diagram p6: schematic, sheet 6, part 2 of 2]

### Parts
IC1  STM32MP157AAA3  [BGA448C80P22X22_1800X1800X127]
Unconnected: IC1.A1(VSS) IC1.A2(PH5) IC1.A3(PH4) IC1.A4(PE13) IC1.A5(PK6) IC1.A6(PK4) IC1.A7(PJ13) IC1.A8(PD10) IC1.A9(PD5) IC1.A10(PE3) IC1.A11(PA9) IC1.A12(PB3) IC1.A13(PB14) IC1.A14(VDD_DSI) IC1.A15(DSI_D0N) IC1.A16(DSI_CKN) IC1.A17(DSI_D1N) IC1.A18(VDD_1V2_DSI_PHY) IC1.A19(VSS) IC1.A20(DDR_DQ20) IC1.A21(DDR_DQ23) IC1.A22(VSS) IC1.AA1(PG13) IC1.AA2(PG14) IC1.AA3(PA0) IC1.AA4(VSS) IC1.AA5(PB1) IC1.AA6(PC5) IC1.AA7(PB12) IC1.AA8(PB5) IC1.AA9(PG10) IC1.AA10(PF7) IC1.AA11(PF6) IC1.AA12(BYPASS_REG1V8) IC1.AA13(VSS_USBHS) IC1.AA14(USB_DM2) IC1.AA15(USB_DP1) IC1.AA16(VSS_USBHS) IC1.AA17(USB_RREF) IC1.AA18(VSS) IC1.AA19(DDR_ATO) IC1.AA20(DDR_DQ29) IC1.AA21(DDR_DQ28) IC1.AA22(DDR_DQM3) IC1.AB1(VSS) IC1.AB2(PA2) IC1.AB3(PC1) IC1.AB4(PG4) IC1.AB5(PB0) IC1.AB6(PC4) IC1.AB7(PH2) IC1.AB8(PB8) IC1.AB9(PD11) IC1.AB10(PF8) IC1.AB11(PF9) IC1.AB12(VDDA_1V8_REG) IC1.AB13(VDD_3V3__USBHS) IC1.AB14(USB_DP2) IC1.AB15(USB_DM1) IC1.AB16(VDD_3V3__USBFS) IC1.AB17(VDDA_1V1_REG) IC1.AB18(VSS) IC1.AB19(DDR__VREF) IC1.AB20(DDR_DQ27) IC1.AB21(DDR_DQ26) IC1.AB22(VSS) IC1.B1(PH10) IC1.B2(VSS) IC1.B3(PH11) IC1.B4(PE14) IC1.B5(PK7) IC1.B6(PK3) IC1.B7(PJ14) IC1.B8(PJ12) IC1.B9(PF1) IC1.B10(PD1) IC1.B11(PD3) IC1.B12(PB15) IC1.B13(PA8) IC1.B14(VDDA_1V8_DSI) IC1.B15(DSI_D0P) IC1.B16(DSI_CKP) IC1.B17(DSI_D1P) IC1.B18(VDD_1V2_DSI_REG) IC1.B19(VSS) IC1.B20(DDR_DQ19) IC1.B21(DDR_DQ16) IC1.B22(DDR_DQS2N) IC1.C1(PH15) IC1.C2(PH14) IC1.C3(VSS) IC1.C4(PE15) IC1.C5(PE0) IC1.C6(PK5) IC1.C7(PJ15) IC1.C8(VSS) IC1.C9(PD4) IC1.C10(PD0) IC1.C11(VSS) IC1.C12(PE5) IC1.C13(PB4) IC1.C14(VSS_DSI) IC1.C15(VSS_DSI) IC1.C16(VSS_DSI) IC1.C17(VSS_DSI) IC1.C18(VSS_DSI) IC1.C19(VSS) IC1.C20(VSS) IC1.C21(DDR_DQS2P) IC1.C22(DDR_DQM2) IC1.D1(PI0) IC1.D2(PI14) IC1.D3(PH13) IC1.D4(VSS) IC1.D5(PE11) IC1.D6(PH8) IC1.D7(PE1) IC1.D8(PK0) IC1.D9(PF5) IC1.D10(PG15) IC1.D11(PG6) IC1.D12(PD2) IC1.D13(PC7) IC1.D14(PC9) IC1.D15(PC11) IC1.D16(JTDI) IC1.D17(JTCK/SWCLK) IC1.D18(VDD_PLL) IC1.D19(VSS_PLL_2) IC1.D20(DDR_DQ22) IC1.D21(DDR_DQ17) IC1.D22(DDR_DQ18) IC1.E1(PI2) IC1.E2(PI1) IC1.E3(PI3) IC1.E4(PE12) IC1.E5(VSS) IC1.E6(PH9) IC1.E7(PK1) IC1.E8(PK2) IC1.E9(PE6) IC1.E10(PF0) IC1.E11(PA15) IC1.E12(PC12) IC1.E13(PC6) IC1.E14(PC8) IC1.E15(!JTRST) IC1.E16(JTDO/TRACE/SWO) IC1.E17(JTMS/SWDIO) IC1.E18(VDDQ_DDR) IC1.E19(VSS) IC1.E20(DDR_DQ3) IC1.E21(DDR_DQ0) IC1.E22(DDR_DQ21) IC1.F1(PI7) IC1.F2(PI5) IC1.F3(PI15) IC1.F4(PZ3) IC1.F5(PH12) IC1.F6(VSS) IC1.F7(VSS) IC1.F8(VSS) IC1.F9(PF4) IC1.F10(PD7) IC1.F11(PB7) IC1.F12(PB9) IC1.F13(PF2) IC1.F14(PC10) IC1.F15(PE4) IC1.F16(VSS) IC1.F17(VDDQ_DDR) IC1.F18(DDR_A7) IC1.F19(!DDR_RESET!) IC1.F20(VSS) IC1.F21(DDR_DQ1) IC1.G1(PZ4) IC1.G2(PZ0) IC1.G3(PZ6) IC1.G4(VSS) IC1.G5(PI6) IC1.G6(VSS) IC1.G8(VSS) IC1.G10(VSS) IC1.G12(VSS) IC1.G14(VSS) IC1.G16(VDDQ_DDR) IC1.G17(VSS) IC1.G18(DDR_A13) IC1.G19(DDR_DQ7) IC1.G20(DDR_DQM0) IC1.G21(DDR_DQS0N) IC1.G22(DDR_DQS0P) IC1.H1(PI13) IC1.H2(PI12) IC1.H3(PZ7) IC1.H4(PZ5) IC1.H5(PZ1) IC1.H6(PJ8) IC1.H7(VSS) IC1.H9(VDDCORE) IC1.H11(VDDCORE) IC1.H13(VDDCORE) IC1.H15(VDDCORE) IC1.H17(VDDQ_DDR) IC1.H18(DDR_A9) IC1.H19(DDR_A5) IC1.H20(DDR_DQ5) IC1.H21(DDR_DQ2) IC1.H22(DDR_DQ6) IC1.J1(PJ3) IC1.J2(PJ0) IC1.J3(PJ10) IC1.J4(PG12) IC1.J5(PI9) IC1.J6(PI4) IC1.J8(VDDCORE) IC1.J9(VSS) IC1.J10(VDDCORE) IC1.J11(VSS) IC1.J12(VDDCORE) IC1.J13(VSS) IC1.J14(VDDCORE) IC1.J16(VDDQ_DDR) IC1.J17(VSS) IC1.J18(DDR_A2) IC1.J19(DDR_A3) IC1.J20(VSS) IC1.J21(DDR_DQ4) IC1.K1(PJ5) IC1.K2(PJ4) IC1.K3(VSS) IC1.K4(PJ2) IC1.K5(PZ2) IC1.K6(PJ11) IC1.K7(VSS) IC1.K9(VDDCORE) IC1.K10(VSS) IC1.K11(VDDCORE) IC1.K12(VSS) IC1.K13(VDDCORE) IC1.K14(VSS) IC1.K15(VDDCORE) IC1.K17(VDDQ_DDR) IC1.K18(DDR_BA2) IC1.K19(DDR_A0) IC1.K20(DDR_BA0) IC1.K21(DDR_DTO1) IC1.K22(DDR_ZQ) IC1.L1(PD15) IC1.L2(PJ9) IC1.L3(PD6) IC1.L4(PJ7) IC1.L5(PJ6) IC1.L6(PJ1) IC1.L8(VDDCORE) IC1.L9(VSS) IC1.L10(VDDCORE) IC1.L11(VSS) IC1.L12(VDDCORE) IC1.L13(VSS) IC1.L14(VDDCORE) IC1.L16(VDDQ_DDR) IC1.L17(VSS) IC1.L18(!DDR_CS!) IC1.L19(VSS) IC1.L20(VSS) IC1.L21(DDR_ODT) IC1.L22(DDR_DTO0) IC1.M1(PD8) IC1.M2(PD9) IC1.M3(PD14) IC1.M4(VBAT) IC1.M5(VSS_PLL) IC1.M6(VDD_PLL) IC1.M7(VSS) IC1.M9(VDD) IC1.M10(VSS) IC1.M11(VDDCORE) IC1.M12(VSS) IC1.M13(VDDCORE) IC1.M14(VSS) IC1.M15(VDDCORE) IC1.M17(VDDQ_DDR) IC1.M18(DDR_A1) IC1.M19(DDR_A15) IC1.M20(!DDR_RAS!) IC1.M21(!DDR_WE!) IC1.M22(!DDR_CAS!) IC1.N1(PI8) IC1.N2(PC13) IC1.N3(BOOT0) IC1.N4(BOOT1) IC1.N5(VDD_ANA) IC1.N6(VREF-) IC1.N8(VDD) IC1.N9(VSS) IC1.N10(VDD) IC1.N11(VSS) IC1.N12(VDDCORE) IC1.N13(VSS) IC1.N14(VDDCORE) IC1.N16(VDDQ_DDR) IC1.N17(VSS) IC1.N18(DDR_A10) IC1.N19(DDR_A12) IC1.N20(DDR_CLKP) IC1.N21(DDR_CLKN) IC1.N22(DDR_DQ8) IC1.P1(PC14-_OSC32__IN) IC1.P2(PC15-_OSC32__OUT) IC1.P3(VSS) IC1.P4 IC1.P5(VSS_ANA) IC1.P6(VREF+) IC1.P7(VSS) IC1.P9(VDD) IC1.P10(VSS) IC1.P11(VDD) IC1.P12(VSS) IC1.P13(VDDCORE) IC1.P14(VSS) IC1.P15(VDDCORE) IC1.P17(VDDQ_DDR) IC1.P18(DDR_A14) IC1.P19(DDR_A11) IC1.P20(VSS) IC1.P21(DDR_DQ10) IC1.R1(!RST_CORE!) IC1.R2(!RST!) IC1.R3(PA14) IC1.R4(ANA0) IC1.R5(VDDA) IC1.R6(VSSA) IC1.R8(VSS) IC1.R10(VDD) IC1.R12(VDD) IC1.R14(VDDCORE) IC1.R16(VDDQ_DDR) IC1.R17(VSS) IC1.R18(DDR_BA1) IC1.R19(DDR_CKE) IC1.R20(DDR_DQ13) IC1.R21(DDR_DQ9) IC1.R22(DDR_DQS1N) IC1.T1(PH0-_OSC_IN) IC1.T2(PH1-_OSC__OUT) IC1.T3(PI11) IC1.T4(PA3) IC1.T5(ANA1) IC1.T6(VSSA) IC1.T7(VSS) IC1.T9(VSS) IC1.T11(VSS) IC1.T13(VDD) IC1.T15(VDDCORE) IC1.T17(VDDQ_DDR) IC1.T18(DDR_A4) IC1.T19(VSS) IC1.T20(DDR_DQ11) IC1.T21(DRR_DQM1) IC1.T22(DDR_DQS1P) IC1.U1(PWR_LP) IC1.U2(PDR_ON_CORE) IC1.U3(PC3) IC1.U4(PG3) IC1.U5(PA5) IC1.U6(VSSA) IC1.U7(VSS) IC1.U8(PG5) IC1.U9(VDD) IC1.U10(PC0) IC1.U11(PG11) IC1.U12(VDD) IC1.U13(VSS) IC1.U14(VDD) IC1.U15(VSS) IC1.U16(VDDQ_DDR) IC1.U17(VSS) IC1.U18(DDR_A8) IC1.U19(DDR_A6) IC1.U20(VSS) IC1.U21(DDR_DQ14) IC1.V1(PWR_ON) IC1.V2(PDR_ON) IC1.V3(PF3) IC1.V4(PA1) IC1.V5(VSS) IC1.V6(PA4) IC1.V7(PF14) IC1.V8(PF12) IC1.V9(PB10) IC1.V10(PB13) IC1.V11(PH6) IC1.V12(PF10) IC1.V13(PB2) IC1.V14(PD13) IC1.V15(OTG_VBUS) IC1.V16(VSS) IC1.V17(VDDQ_DDR) IC1.V18(VSS) IC1.V19(VSS) IC1.V20(DDR_DQ12) IC1.V21(DDR_DQ15) IC1.V22(DDR_DQ24) IC1.W1(PI10) IC1.W2(PH7) IC1.W3(PA13) IC1.W4(PG2) IC1.W5(PG0) IC1.W6(PF15) IC1.W7(PF13) IC1.W8(PF11) IC1.W9(PA6) IC1.W10(PE7) IC1.W11(PE9) IC1.W12(PD12) IC1.W13(PB6) IC1.W14(PE10) IC1.W15(PG9) IC1.W16(PA12) IC1.W17(VSS) IC1.W18(VDDQ_DDR) IC1.W19(VSS) IC1.W20(DDR_DQ25) IC1.W21(DDR_DQ31) IC1.W22(DDR_DQ30) IC1.Y1(PC2) IC1.Y2(PE2) IC1.Y3(VSS) IC1.Y4(PG1) IC1.Y5(PB11) IC1.Y6(PH3) IC1.Y7(VSS) IC1.Y8(PG8) IC1.Y9(PA7) IC1.Y10(VSS) IC1.Y11(PG7) IC1.Y12(PE8) IC1.Y13(VSS_USBHS) IC1.Y14(VSS_USBHS) IC1.Y15(VSS_USBHS) IC1.Y16(PA11) IC1.Y17(PA10) IC1.Y18(VSS) IC1.Y19(VDDQ_DDR) IC1.Y20(VSS) IC1.Y21(DDR_DQS3P) IC1.Y22(DDR_DQS3N)

## Sheet 7 of 12
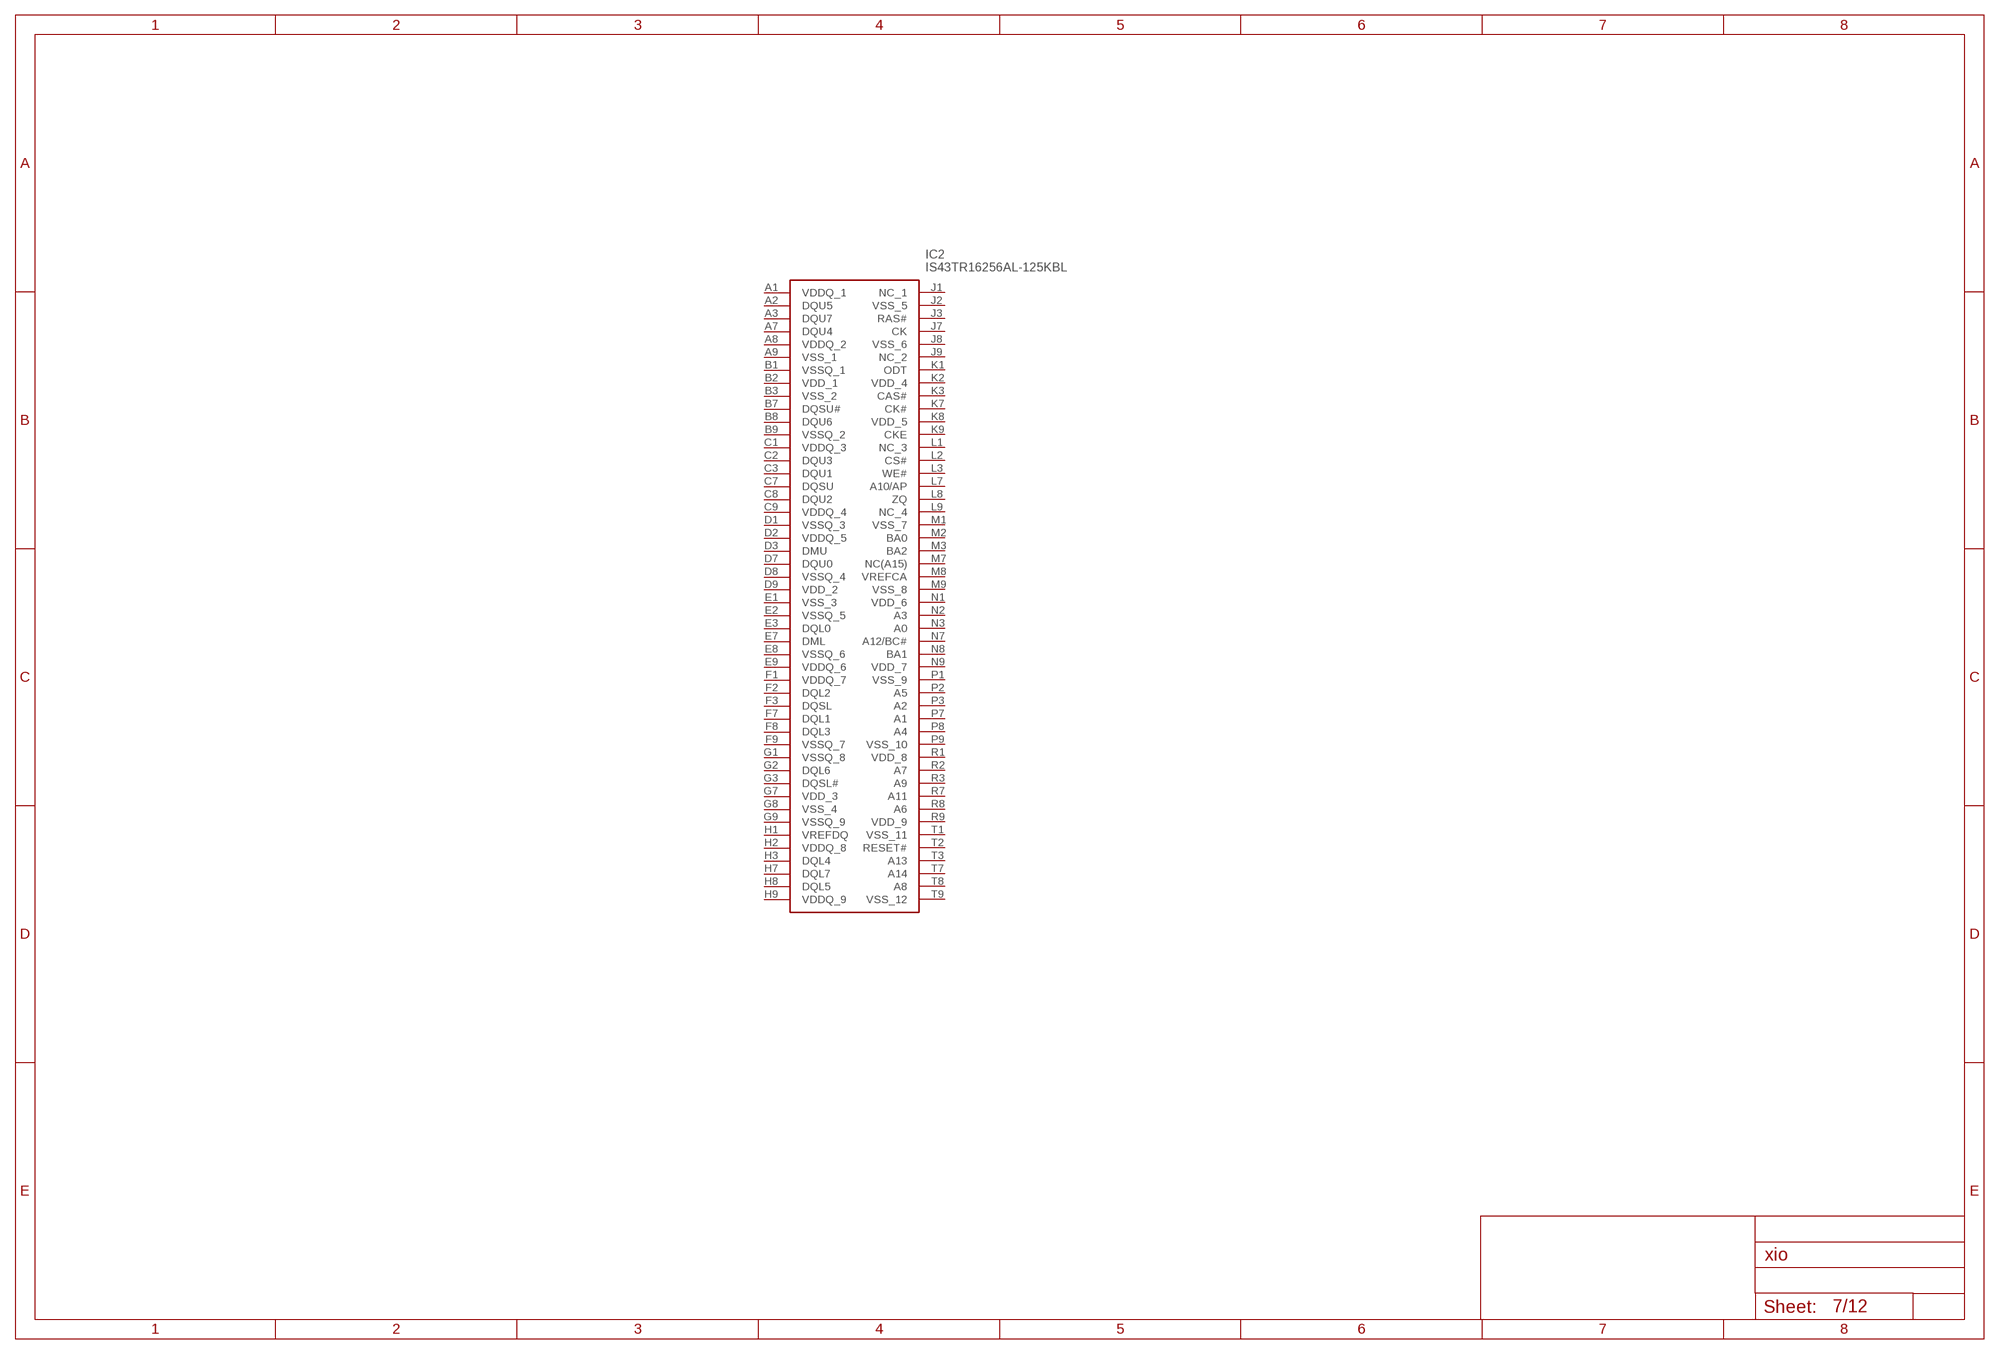
[diagram p7: schematic, sheet 7]

### Parts
IC2  IS43TR16256AL-125KBL  [BGA96C80P9X16_900X1300X120]
Unconnected: IC2.A1(VDDQ_1) IC2.A2(DQU5) IC2.A3(DQU7) IC2.A7(DQU4) IC2.A8(VDDQ_2) IC2.A9(VSS_1) IC2.B1(VSSQ_1) IC2.B2(VDD_1) IC2.B3(VSS_2) IC2.B7(DQSU#) IC2.B8(DQU6) IC2.B9(VSSQ_2) IC2.C1(VDDQ_3) IC2.C2(DQU3) IC2.C3(DQU1) IC2.C7(DQSU) IC2.C8(DQU2) IC2.C9(VDDQ_4) IC2.D1(VSSQ_3) IC2.D2(VDDQ_5) IC2.D3(DMU) IC2.D7(DQU0) IC2.D8(VSSQ_4) IC2.D9(VDD_2) IC2.E1(VSS_3) IC2.E2(VSSQ_5) IC2.E3(DQL0) IC2.E7(DML) IC2.E8(VSSQ_6) IC2.E9(VDDQ_6) IC2.F1(VDDQ_7) IC2.F2(DQL2) IC2.F3(DQSL) IC2.F7(DQL1) IC2.F8(DQL3) IC2.F9(VSSQ_7) IC2.G1(VSSQ_8) IC2.G2(DQL6) IC2.G3(DQSL#) IC2.G7(VDD_3) IC2.G8(VSS_4) IC2.G9(VSSQ_9) IC2.H1(VREFDQ) IC2.H2(VDDQ_8) IC2.H3(DQL4) IC2.H7(DQL7) IC2.H8(DQL5) IC2.H9(VDDQ_9) IC2.J1(NC_1) IC2.J2(VSS_5) IC2.J3(RAS#) IC2.J7(CK) IC2.J8(VSS_6) IC2.J9(NC_2) IC2.K1(ODT) IC2.K2(VDD_4) IC2.K3(CAS#) IC2.K7(CK#) IC2.K8(VDD_5) IC2.K9(CKE) IC2.L1(NC_3) IC2.L2(CS#) IC2.L3(WE#) IC2.L7(A10/AP) IC2.L8(ZQ) IC2.L9(NC_4) IC2.M1(VSS_7) IC2.M2(BA0) IC2.M3(BA2) IC2.M7(NC(A15)) IC2.M8(VREFCA) IC2.M9(VSS_8) IC2.N1(VDD_6) IC2.N2(A3) IC2.N3(A0) IC2.N7(A12/BC#) IC2.N8(BA1) IC2.N9(VDD_7) IC2.P1(VSS_9) IC2.P2(A5) IC2.P3(A2) IC2.P7(A1) IC2.P8(A4) IC2.P9(VSS_10) IC2.R1(VDD_8) IC2.R2(A7) IC2.R3(A9) IC2.R7(A11) IC2.R8(A6) IC2.R9(VDD_9) IC2.T1(VSS_11) IC2.T2(RESET#) IC2.T3(A13) IC2.T7(A14) IC2.T8(A8) IC2.T9(VSS_12)

## Sheet 8 of 12
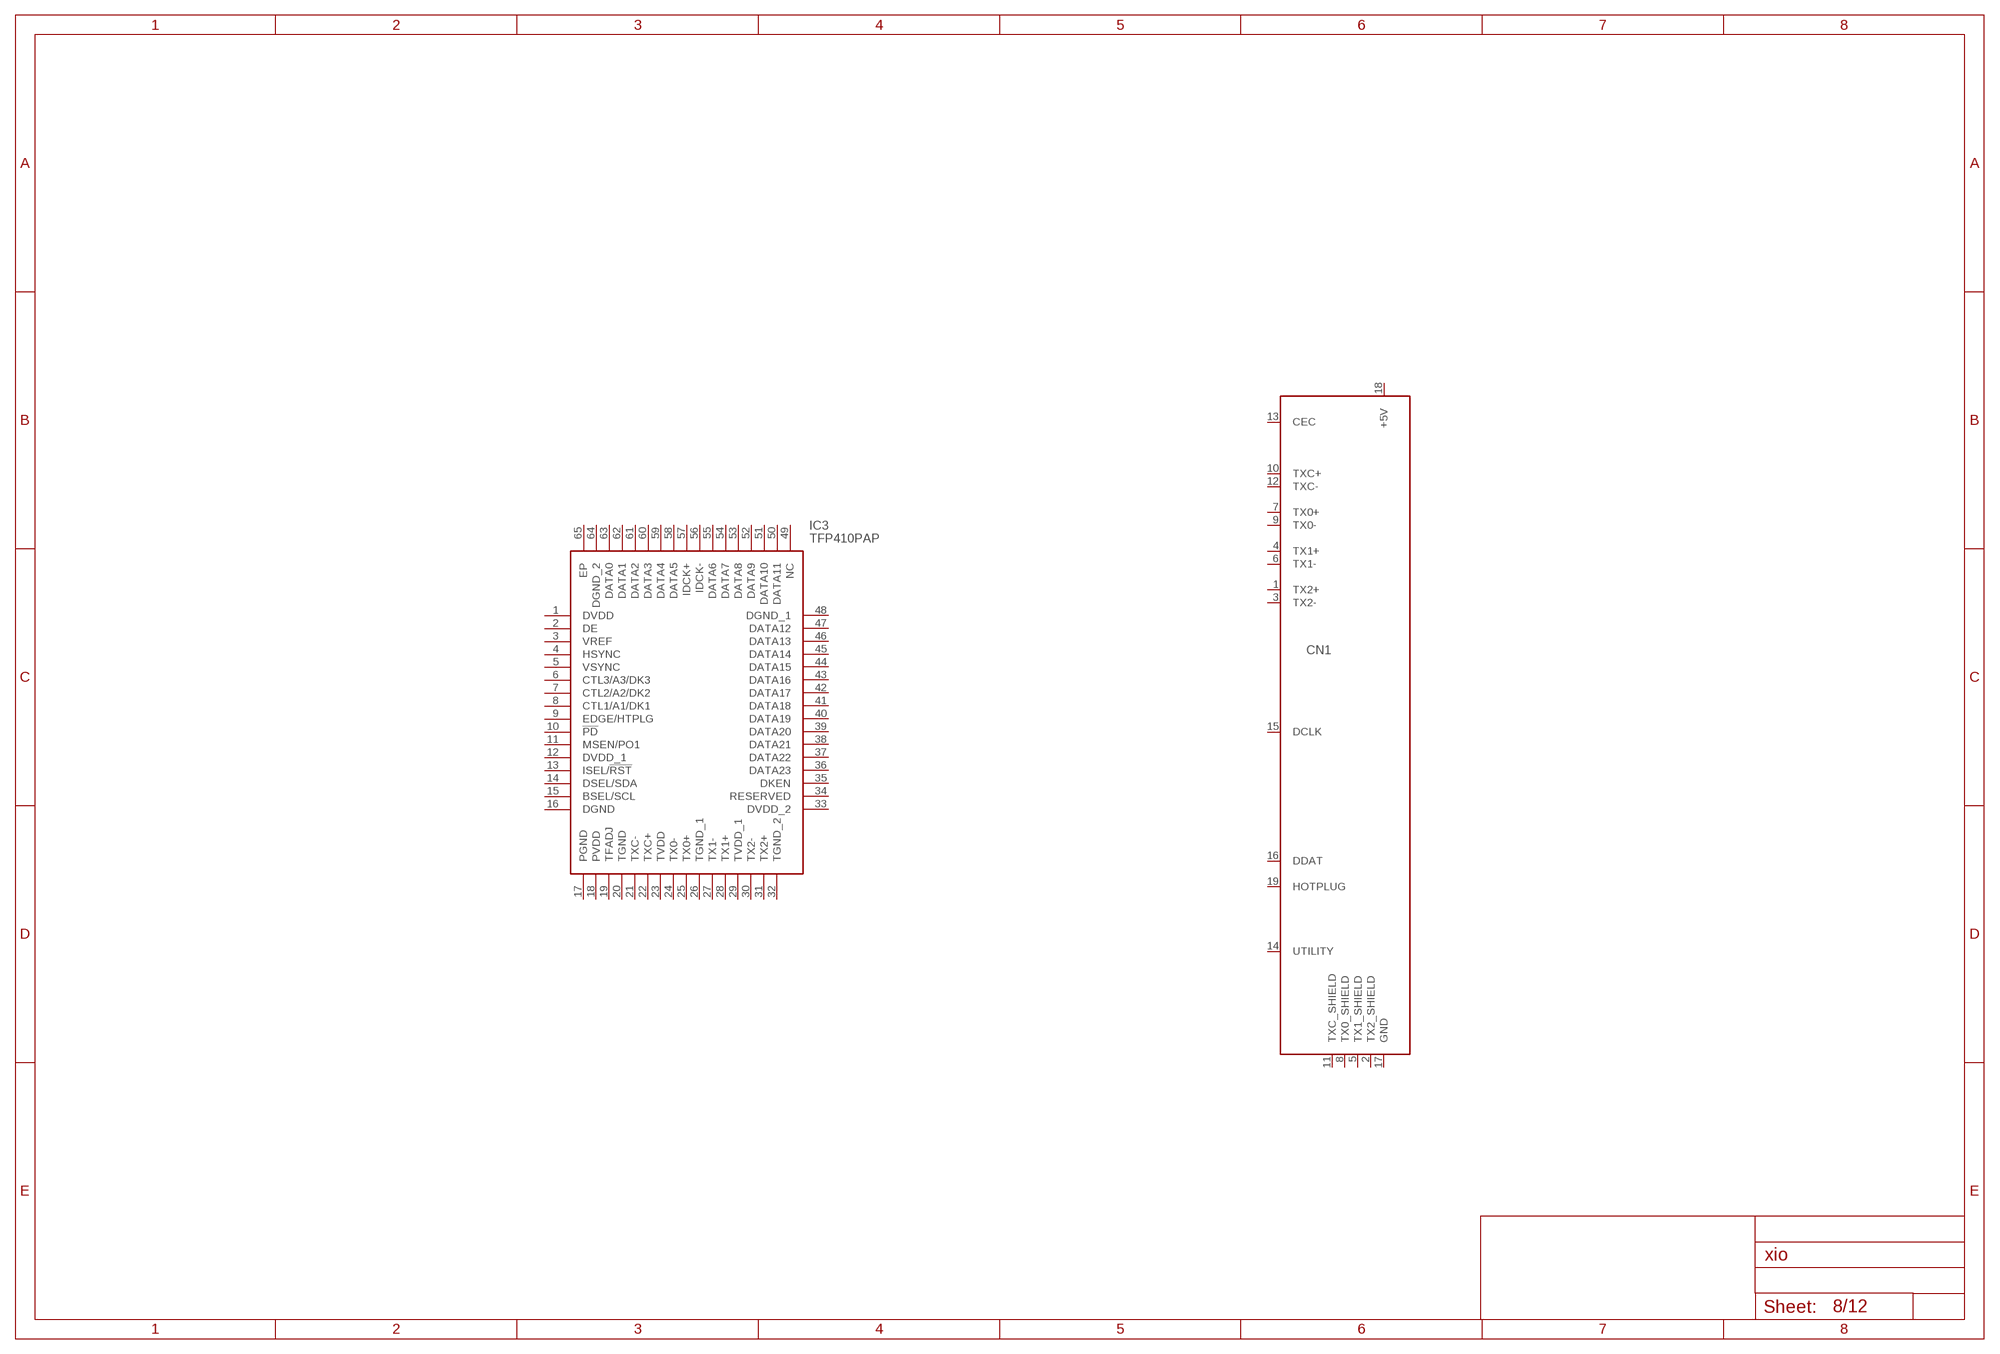
[diagram p8: schematic, sheet 8]

### Parts
CN1  HDMI_MOLEX_47151-0001  [HDMI_MOLEX_47151-0001]
IC3  TFP410PAP  [QFP50P1200X1200X120-65N]
Unconnected: CN1.1(TX2+) CN1.3(TX2-) CN1.4(TX1+) CN1.6(TX1-) CN1.7(TX0+) CN1.9(TX0-) CN1.10(TXC+) CN1.12(TXC-) CN1.13(CEC) CN1.14(UTILITY) CN1.15(DCLK) CN1.16(DDAT) CN1.19(HOTPLUG) IC3.2(DE) IC3.3(VREF) IC3.4(HSYNC) IC3.5(VSYNC) IC3.6(CTL3/A3/DK3) IC3.7(CTL2/A2/DK2) IC3.8(CTL1/A1/DK1) IC3.9(EDGE/HTPLG) IC3.10(!PD) IC3.11(MSEN/PO1) IC3.13(ISEL/!RST) IC3.14(DSEL/SDA) IC3.15(BSEL/SCL) IC3.19(TFADJ) IC3.21(TXC-) IC3.22(TXC+) IC3.24(TX0-) IC3.25(TX0+) IC3.27(TX1-) IC3.28(TX1+) IC3.30(TX2-) IC3.31(TX2+) IC3.34(RESERVED) IC3.35(DKEN) IC3.36(DATA23) IC3.37(DATA22) IC3.38(DATA21) IC3.39(DATA20) IC3.40(DATA19) IC3.41(DATA18) IC3.42(DATA17) IC3.43(DATA16) IC3.44(DATA15) IC3.45(DATA14) IC3.46(DATA13) IC3.47(DATA12) IC3.49(NC) IC3.50(DATA11) IC3.51(DATA10) IC3.52(DATA9) IC3.53(DATA8) IC3.54(DATA7) IC3.55(DATA6) IC3.56(IDCK-) IC3.57(IDCK+) IC3.58(DATA5) IC3.59(DATA4) IC3.60(DATA3) IC3.61(DATA2) IC3.62(DATA1) IC3.63(DATA0) IC3.65(EP)

## Sheet 9 of 12
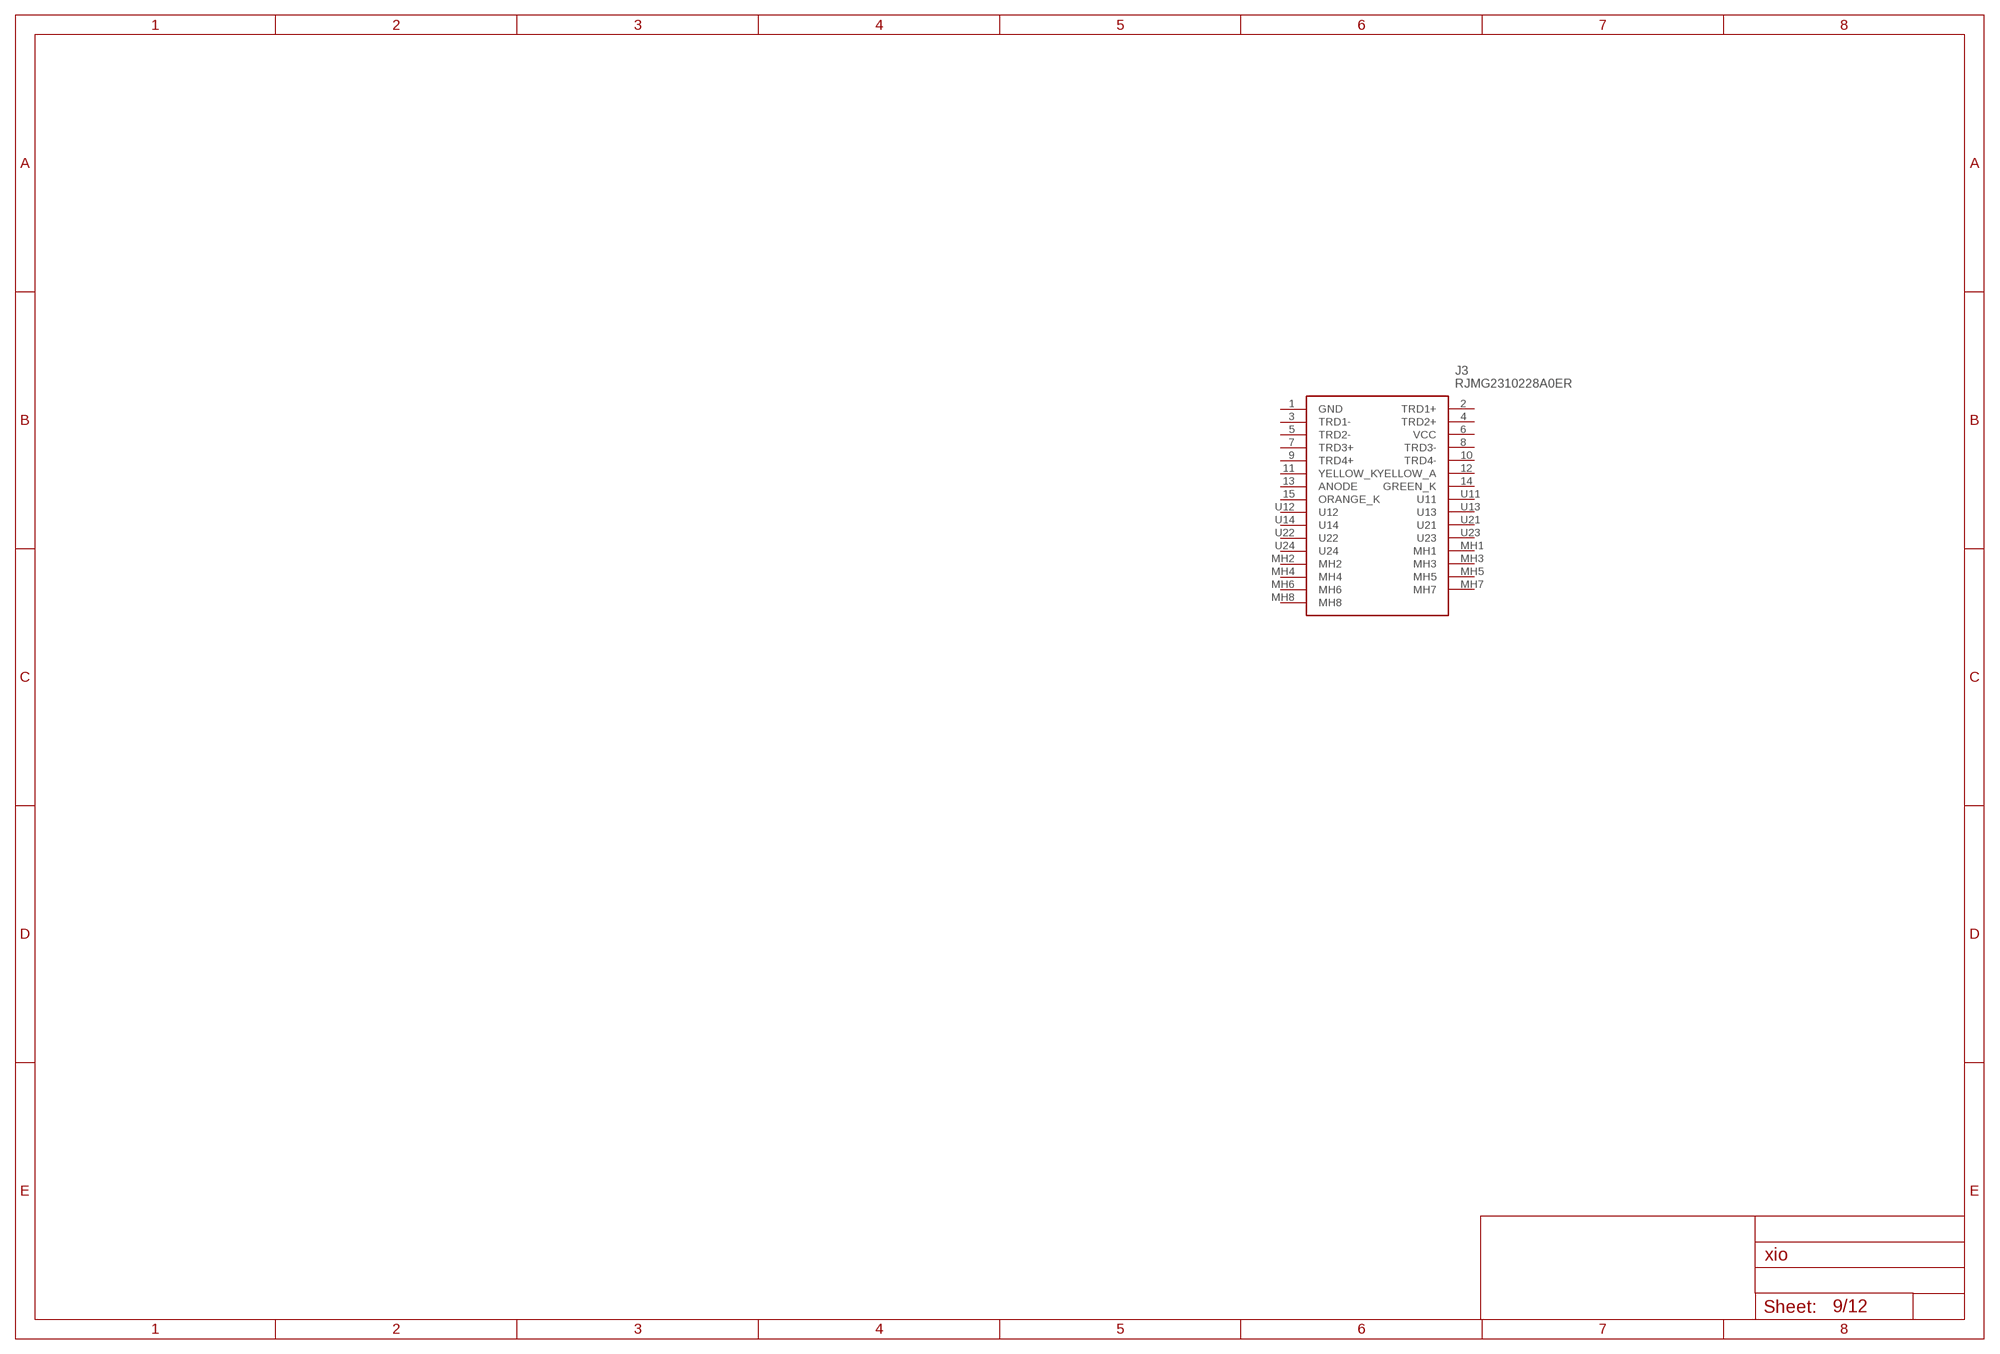
[diagram p9: schematic, sheet 9]

### Parts
J3  RJMG2310228A0ER  [RJMG2310228A0ER]
Unconnected: J3.1(GND) J3.2(TRD1+) J3.3(TRD1-) J3.4(TRD2+) J3.5(TRD2-) J3.6(VCC) J3.7(TRD3+) J3.8(TRD3-) J3.9(TRD4+) J3.10(TRD4-) J3.11(YELLOW_K) J3.12(YELLOW_A) J3.13(ANODE) J3.14(GREEN_K) J3.15(ORANGE_K) J3.MH1 J3.MH2 J3.MH3 J3.MH4 J3.MH5 J3.MH6 J3.MH7 J3.MH8 J3.U11 J3.U12 J3.U13 J3.U14 J3.U21 J3.U22 J3.U23 J3.U24

## Sheet 10 of 12
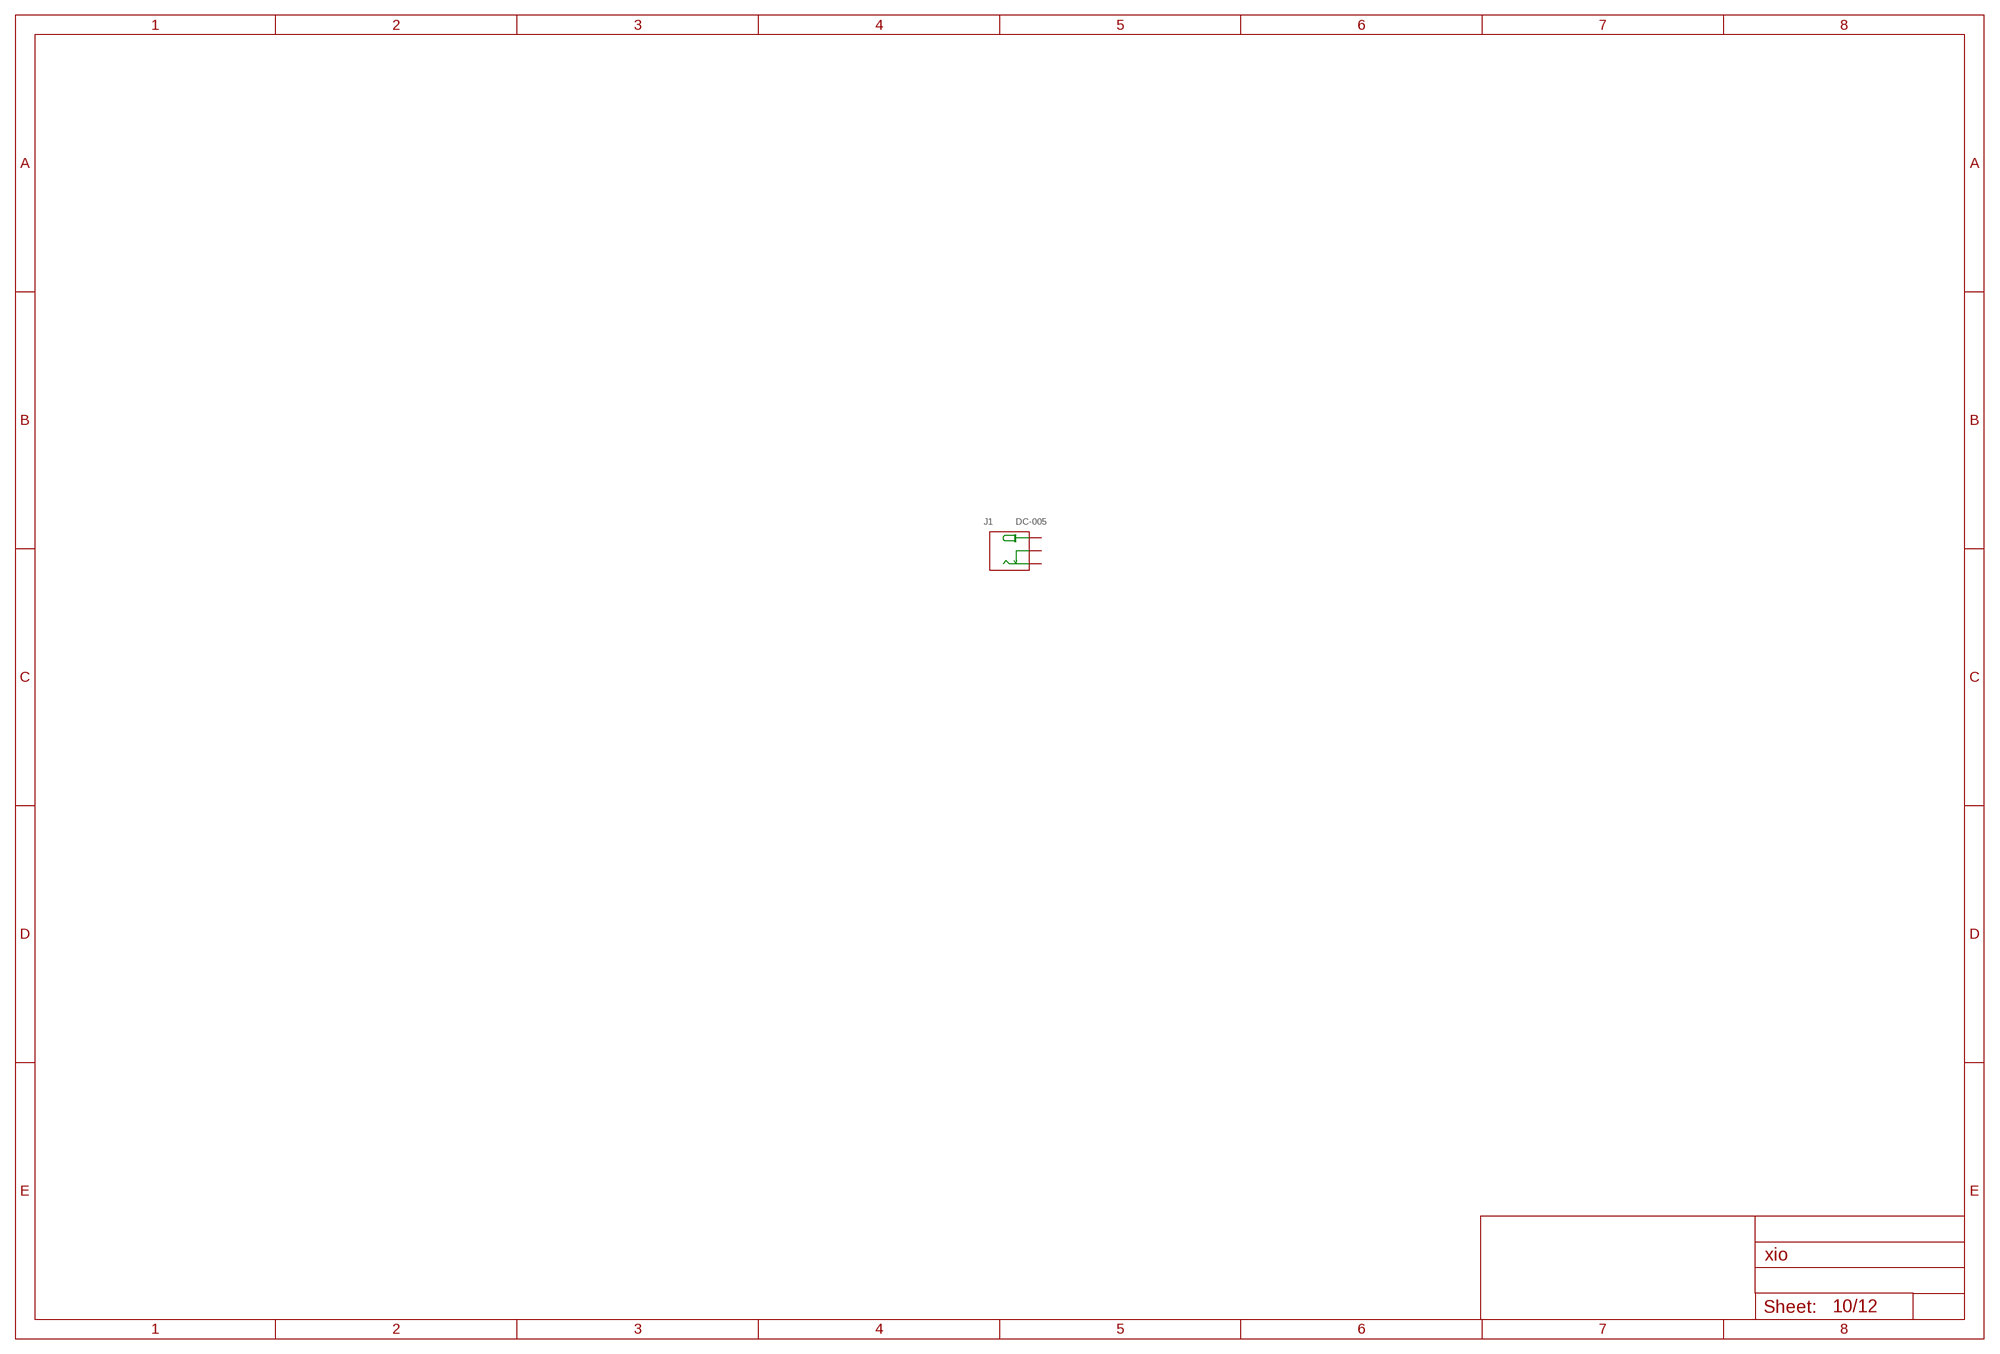
[diagram p10: schematic, sheet 10]

### Parts
J1  DC-005  CONN-POWER-JACK-2.1MM(DC-005)  [DCJ3P-14.2X11.0X9.0MM]
Unconnected: J1.+ J1.-1(-) J1.-2(CDN)

## Sheet 11 of 12
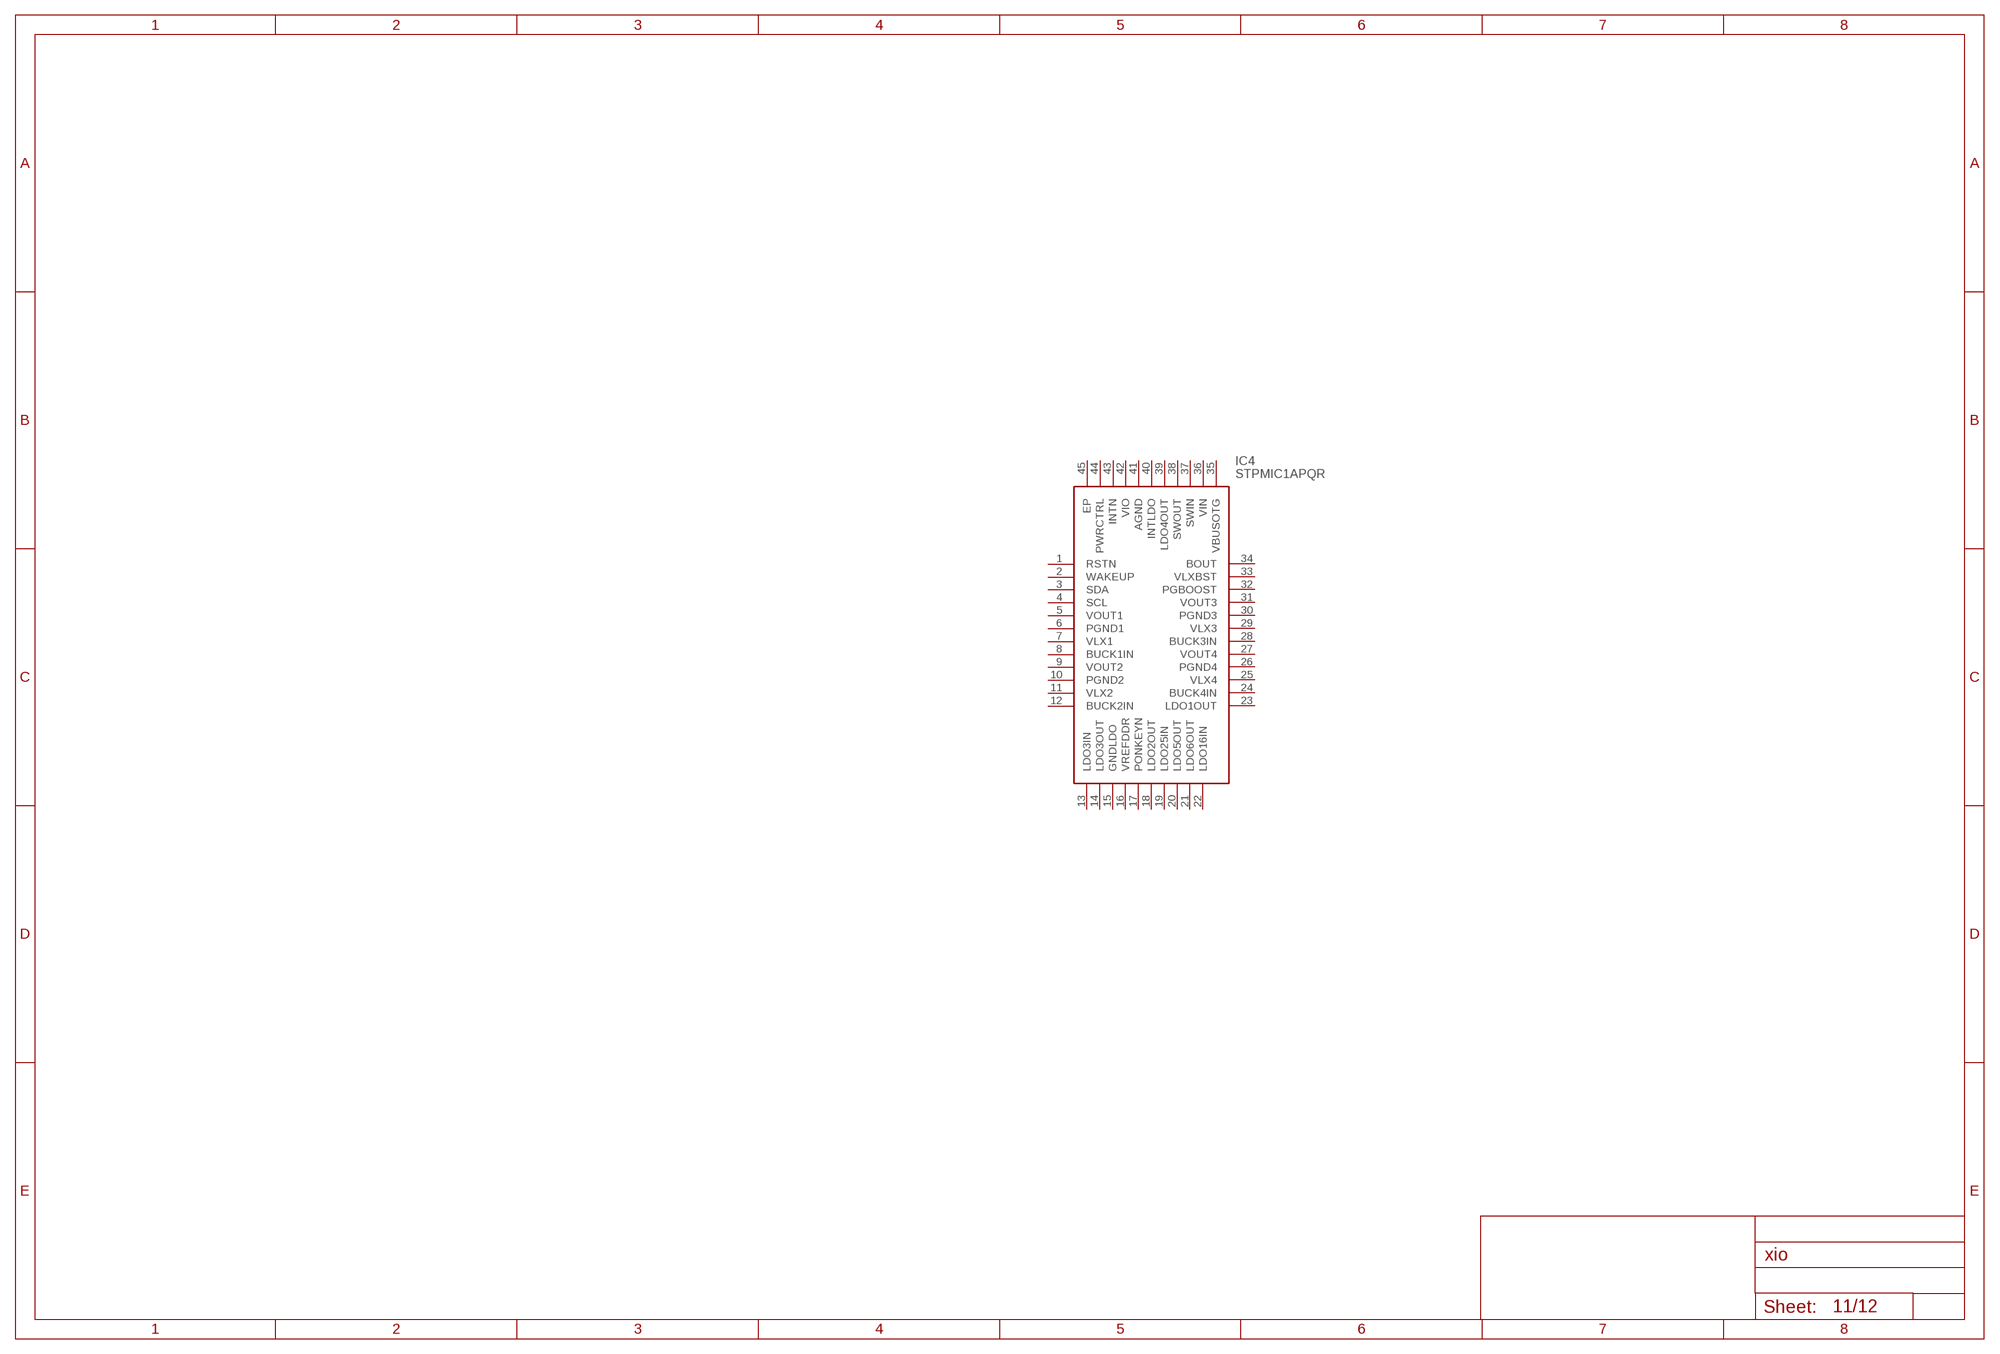
[diagram p11: schematic, sheet 11]

### Parts
IC4  STPMIC1APQR  [QFN40P500X600X80-45N]
Unconnected: IC4.1(RSTN) IC4.2(WAKEUP) IC4.3(SDA) IC4.4(SCL) IC4.5(VOUT1) IC4.6(PGND1) IC4.7(VLX1) IC4.8(BUCK1IN) IC4.9(VOUT2) IC4.10(PGND2) IC4.11(VLX2) IC4.12(BUCK2IN) IC4.13(LDO3IN) IC4.14(LDO3OUT) IC4.15(GNDLDO) IC4.16(VREFDDR) IC4.17(PONKEYN) IC4.18(LDO2OUT) IC4.19(LDO25IN) IC4.20(LDO5OUT) IC4.21(LDO6OUT) IC4.22(LDO16IN) IC4.23(LDO1OUT) IC4.24(BUCK4IN) IC4.25(VLX4) IC4.26(PGND4) IC4.27(VOUT4) IC4.28(BUCK3IN) IC4.29(VLX3) IC4.30(PGND3) IC4.31(VOUT3) IC4.32(PGBOOST) IC4.33(VLXBST) IC4.34(BOUT) IC4.35(VBUSOTG) IC4.36(VIN) IC4.37(SWIN) IC4.38(SWOUT) IC4.39(LDO4OUT) IC4.40(INTLDO) IC4.41(AGND) IC4.42(VIO) IC4.43(INTN) IC4.44(PWRCTRL) IC4.45(EP)

## Sheet 12 of 12
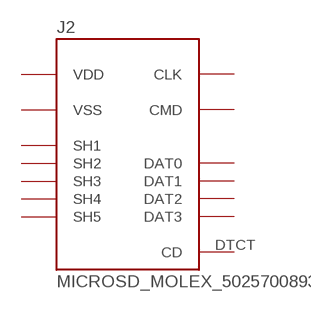
[diagram p12: schematic, sheet 12]

### Parts
J2  MICROSD_MOLEX_5025700893  [5025700893]
Unconnected: J2.DTCT(CD) J2.P$1(DAT2) J2.P$2(DAT3) J2.P$3(CMD) J2.P$5(CLK) J2.P$7(DAT0) J2.P$8(DAT1)

## Power pins joined to a net without a drawn wire
+5V: CN1.18(+5V)
DGND: IC3.16(DGND)
DGND_1: IC3.48(DGND_1)
DGND_2: IC3.64(DGND_2)
DVDD: IC3.1(DVDD)
DVDD_1: IC3.12(DVDD_1)
DVDD_2: IC3.33(DVDD_2)
GND: CN1.17(GND) CN1.P$1(GND) CN1.P$2(GND) CN1.P$3(GND) CN1.P$4(GND)
PGND: IC3.17(PGND)
PVDD: IC3.18(PVDD)
SH1: J2.GND0(SH1)
SH2: J2.GND1(SH2)
SH3: J2.GND2(SH3)
SH4: J2.GND3(SH4)
SH5: J2.GND4(SH5)
TGND: IC3.20(TGND)
TGND_1: IC3.26(TGND_1)
TGND_2: IC3.32(TGND_2)
TVDD: IC3.23(TVDD)
TVDD_1: IC3.29(TVDD_1)
TX0_SHIELD: CN1.8(TX0_SHIELD)
TX1_SHIELD: CN1.5(TX1_SHIELD)
TX2_SHIELD: CN1.2(TX2_SHIELD)
TXC_SHIELD: CN1.11(TXC_SHIELD)
VDD: J2.P$4(VDD)
VSS: J2.P$6(VSS)

## Library data of the parts
C1 C53 C55 C56 C81 = rcl:C-EU: CAPACITOR, European symbol; SPICEPREFIX: C; USE: GRM033C71C104KE14D
CN1 = microbuilder:HDMI_MOLEX_47151-0001; USE: 0471510001
IC1 = samacsys:STM32MP157AAA3: STMICROELECTRONICS - STM32MP157AAA3 - MPU, 32BIT, CORTEX-A7/CORTEX-M4 , LFBGA Source: Datasheet <https://www.st.com/resource/en/datasheet/stm32mp157a.pdf>; DESCRIPTION: STMICROELECTRONICS - STM32MP157AAA3 - MPU, 32BIT, CORTEX-A7/CORTEX-M4 , LFBGA; HEIGHT: 1.27mm; MANUFACTURER_NAME: STMicroelectronics; MANUFACTURER_PART_NUMBER: STM32MP157AAA3; MOUSER_PART_NUMBER: 511-STM32MP157AAA3; MOUSER_PRICE-STOCK: https://www.mouser.com/Search/Refine.aspx?Keyword=511-STM32MP157AAA3; USE: STM32MP157AAA3
IC2 = samacsys:IS43TR16256AL-125KBL: SDRAM - DDR3L Memory IC 4Gb (256M x 16) Parallel 800MHz 20ns 96-TWBGA (9x13) Source: Datasheet <http://www.issi.com/WW/pdf/43-46TR16256A-85120AL.pdf>; DESCRIPTION: SDRAM - DDR3L Memory IC 4Gb (256M x 16) Parallel 800MHz 20ns 96-TWBGA (9x13); HEIGHT: 1.2mm; MANUFACTURER_NAME: ISSI, Integrated Silicon Solution Inc; MANUFACTURER_PART_NUMBER: IS43TR16256AL-125KBL; USE: IS43TR16256AL-125KBL
IC3 = samacsys:TFP410PAP: 165-MHz TMDS DVI transmitter/serializer & Panelbus integrated circuit Source: Datasheet <http://www.ti.com/lit/ds/symlink/tfp410.pdf>; DESCRIPTION: 165-MHz TMDS DVI transmitter/serializer & Panelbus integrated circuit; HEIGHT: 1.2mm; MANUFACTURER_NAME: Texas Instruments; MANUFACTURER_PART_NUMBER: TFP410PAP; MOUSER_PART_NUMBER: 595-TFP410PAP; MOUSER_PRICE-STOCK: https://www.mouser.com/Search/Refine.aspx?Keyword=595-TFP410PAP; RS_PART_NUMBER: 5457906P; RS_PRICE-STOCK: http://uk.rs-online.com/web/p/products/5457906P; USE: TFP410PAP
IC4 = samacsys:STPMIC1APQR: STMICROELECTRONICS - STPMIC1APQR - POWER MANAGEMENT IC, WFQFN-44 Source: Datasheet <https://www.st.com/resource/en/datasheet/stpmic1.pdf>; DESCRIPTION: STMICROELECTRONICS - STPMIC1APQR - POWER MANAGEMENT IC, WFQFN-44; HEIGHT: 0.8mm; MANUFACTURER_NAME: STMicroelectronics; MANUFACTURER_PART_NUMBER: STPMIC1APQR; MOUSER_PART_NUMBER: 511-STPMIC1APQR; MOUSER_PRICE-STOCK: https://www.mouser.com/Search/Refine.aspx?Keyword=511-STPMIC1APQR; USE: STPMIC1APQR
J1 = Seeed-Connector:CONN-POWER-JACK-2.1MM(DC-005): 320120003; MPN: DC-005; USE: dc-005
J2 = j_microsd_molex_5025700893:MICROSD_MOLEX_5025700893: Molex 5025700893 MicroSD Normal Mount SMT Connector; USE: 5025700893
J3 = samacsys:RJMG2310228A0ER: Modular Connectors / Ethernet Connectors R/A,DipType, USB 2.0 RJ45+OverDual Source: Datasheet <https://componentsearchengine.com/Datasheets/1/RJMG2310228A0ER.pdf>; DESCRIPTION: Modular Connectors / Ethernet Connectors R/A,DipType, USB 2.0 RJ45+OverDual; HEIGHT: 29.66mm; MANUFACTURER_NAME: AMPHENOL COMMERCIAL PRODUCTS; MANUFACTURER_PART_NUMBER: RJMG2310228A0ER; MOUSER_PART_NUMBER: 523-RJMG2310228A0ER; MOUSER_PRICE-STOCK: https://www.mouser.com/Search/Refine.aspx?Keyword=523-RJMG2310228A0ER; USE: RJMG2310228A0ER
LD0 LD1-LD4 = led:LED: LED OSRAM: - CHIPLED LG R971, LG N971, LY N971, LG Q971, LY Q971, LO R971, LY R971 LH N974, LH R974 LS Q976, LO Q976, LY Q976 LO Q996 - Hyper CHIPLED LW Q18S LB Q993, LB Q99A, LB R99A - SideLED LS A670, LO A670, LY A670, LG A670, LP A670 LB A673, LV A673, LT A673, LW A673 LH A674 LY A675 LS A676, LA A676, LO A676, LY A676, LW A676 LS A679, LY A679, LG A679 - Hyper Micro SIDELED® LS Y876, LA Y876, LO Y876, LY Y876 LT Y87S - SmartLED LW L88C, LW L88S LB L89C, LB L89S, LG L890 LS L89K, LO L89K, LY L89K LS L896, LA L896, LO L896, LY L896 - TOPLED LS T670, LO T670, LY T670, LG T670, LP T670 LSG T670, LSP T670, LSY T670, LOP T670, LYG T670 LG T671, LOG T671, LSG T671 LB T673, LV T673, LT T673, LW T673 LH T674 LS T676, LA T676, LO T676, LY T676, LB T676, LH T676, LSB T676, LW T676 LB T67C, LV T67C, LT T67C, LS T67K, LO T67K, LY T67K, LW E67C LS E67B, LA E67B, LO E67B, LY E67B, LB E67C, LV E67C, LT E67C LW T67C LS T679, LY T679, LG T679 LS T770, LO T770, LY T770, LG T770, LP T770 LB T773, LV T773, LT T773, LW T773 LH T774 LS E675, LA E675, LY E675, LS T675 LS T776, LA T776, LO T776, LY T776, LB T776 LHGB T686 LT T68C, LB T68C - Hyper Mini TOPLED® LB M676 - Mini TOPLED Santana® LG M470 LS M47K, LO M47K, LY M47K Source: http://www.osram.convergy.de LUXEON: - LUMILED® LXK2-PW12-R00, LXK2-PW12-S00, LXK2-PW14-U00, LXK2-PW14-V00 LXK2-PM12-R00, LXK2-PM12-S00, LXK2-PM14-U00 LXK2-PE12-Q00, LXK2-PE12-R00, LXK2-PE12-S00, LXK2-PE14-T00, LXK2-PE14-U00 LXK2-PB12-K00, LXK2-PB12-L00, LXK2-PB12-M00, LXK2-PB14-N00, LXK2-PB14-P00, LXK2-PB14-Q00 LXK2-PR12-L00, LXK2-PR12-M00, LXK2-PR14-Q00, LXK2-PR14-R00 LXK2-PD12-Q00, LXK2-PD12-R00, LXK2-PD12-S00 LXK2-PH12-R00, LXK2-PH12-S00 LXK2-PL12-P00, LXK2-PL12-Q00, LXK2-PL12-R00 Source: www.luxeon.com KINGBRIGHT: KA-3528ASYC Source: www.kingbright.com; USE: SML-D12D1WT86
R1-R5 R61-R65 = rcl:R-EU_: RESISTOR, European symbol; SPICEPREFIX: R; USE: ERJ-1GNJ103C
R27 R98 R101 R104 R107 = rcl:R-EU_: RESISTOR, European symbol; SPICEPREFIX: R; USE: RMCF0402FT59R0
SLOT0 SLOT1-SLOT4 = samacsys:10018784-10210TLF: PCI Express / PCI Connectors 36P CARD EDGE ASSM VERTICAL Source: Datasheet <https://componentsearchengine.com/Datasheets/1/10018784-10210TLF.pdf>; DESCRIPTION: PCI Express / PCI Connectors 36P CARD EDGE ASSM VERTICAL; HEIGHT: 11.25mm; MANUFACTURER_NAME: Amphenol; MANUFACTURER_PART_NUMBER: 10018784-10210TLF; MOUSER_PART_NUMBER: 649-1001878410210TLF; MOUSER_PRICE-STOCK: https://www.mouser.com/Search/Refine.aspx?Keyword=649-1001878410210TLF; USE: 10018784-10210TLF
U$1 = pbxl:MPBI+; NOSTUFF: 1
U$3 = sjg-con:MINI-SAS: Mini-SAS connector, right angle through hole Part 1888019-4 Digikey part A111092CT-ND; USE: 1888019-4

## Net classes
1 Power: width 0.305 mm, drill 0.203 mm
2 Slot-power: width 0.508 mm
3 tx100: width 0.254 mm, clearance 0.457 mm
4 usb90: width 0.254 mm, clearance 0.178 mm
5 cclk50: width 0.203 mm
6 3v3: width 0.254 mm
7 vccint_aux: width 0.305 mm
14 qspi: width 0.203 mm

## Board
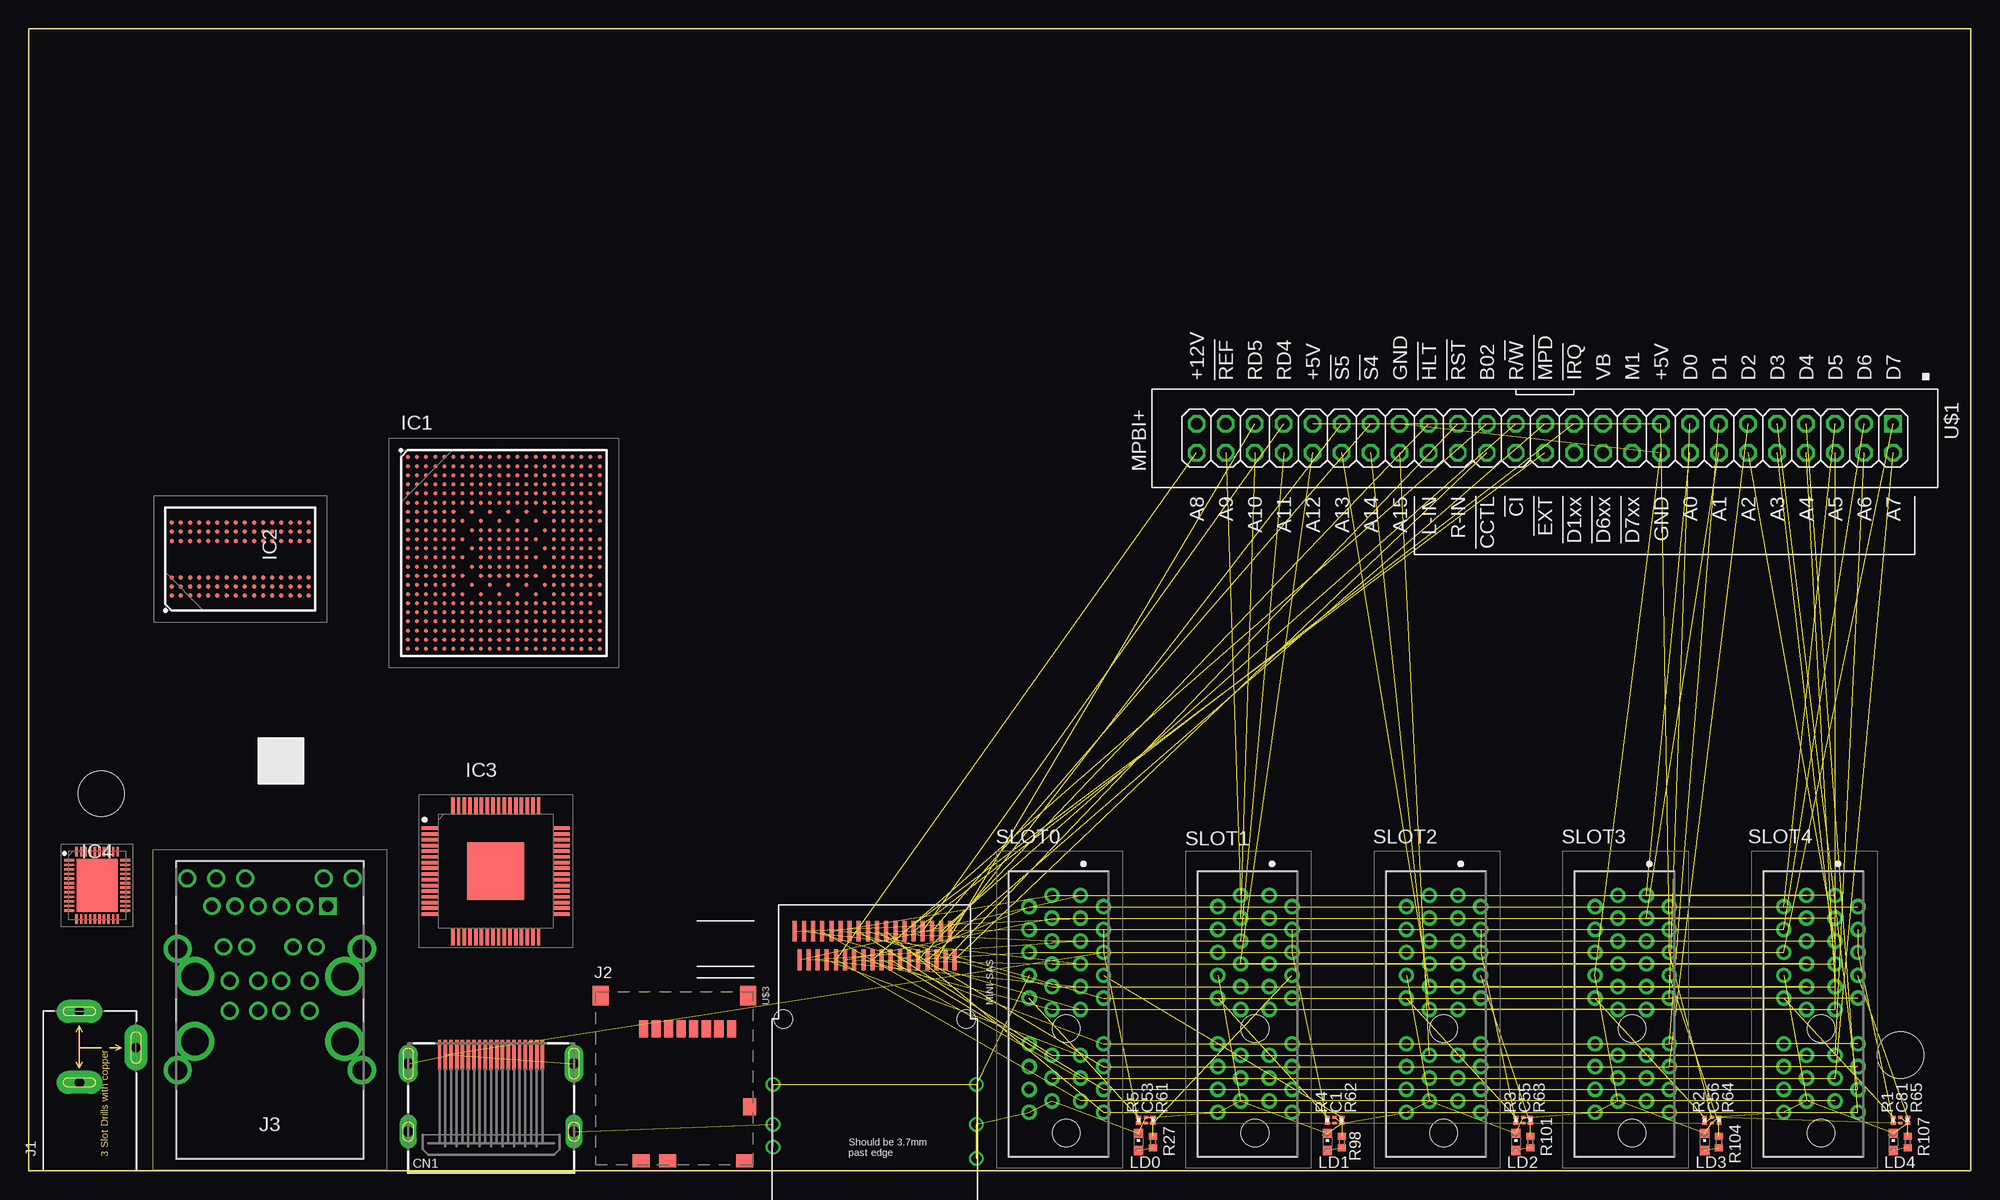
[diagram p13: board, top side]
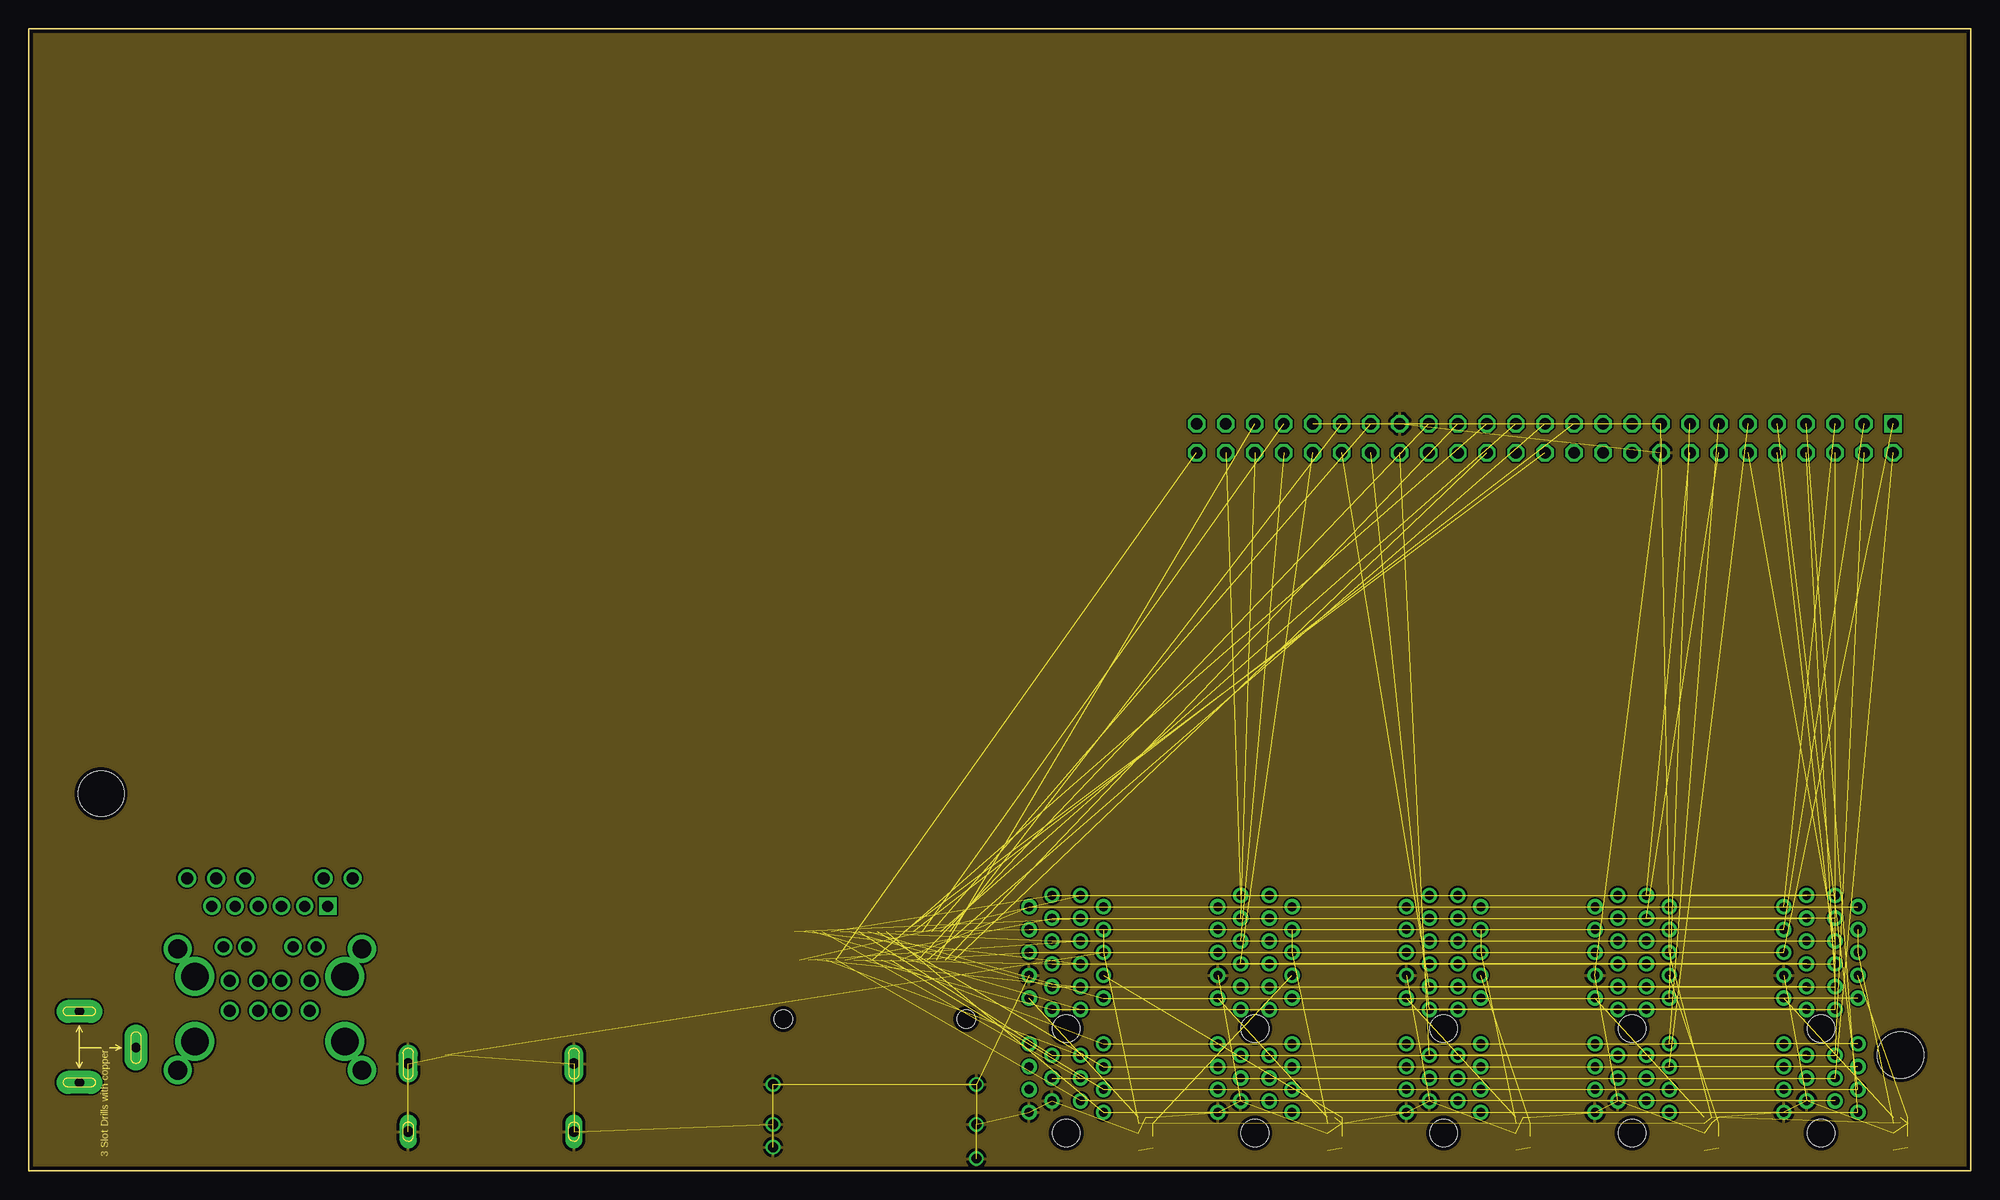
[diagram p14: board, inner layer Route2]
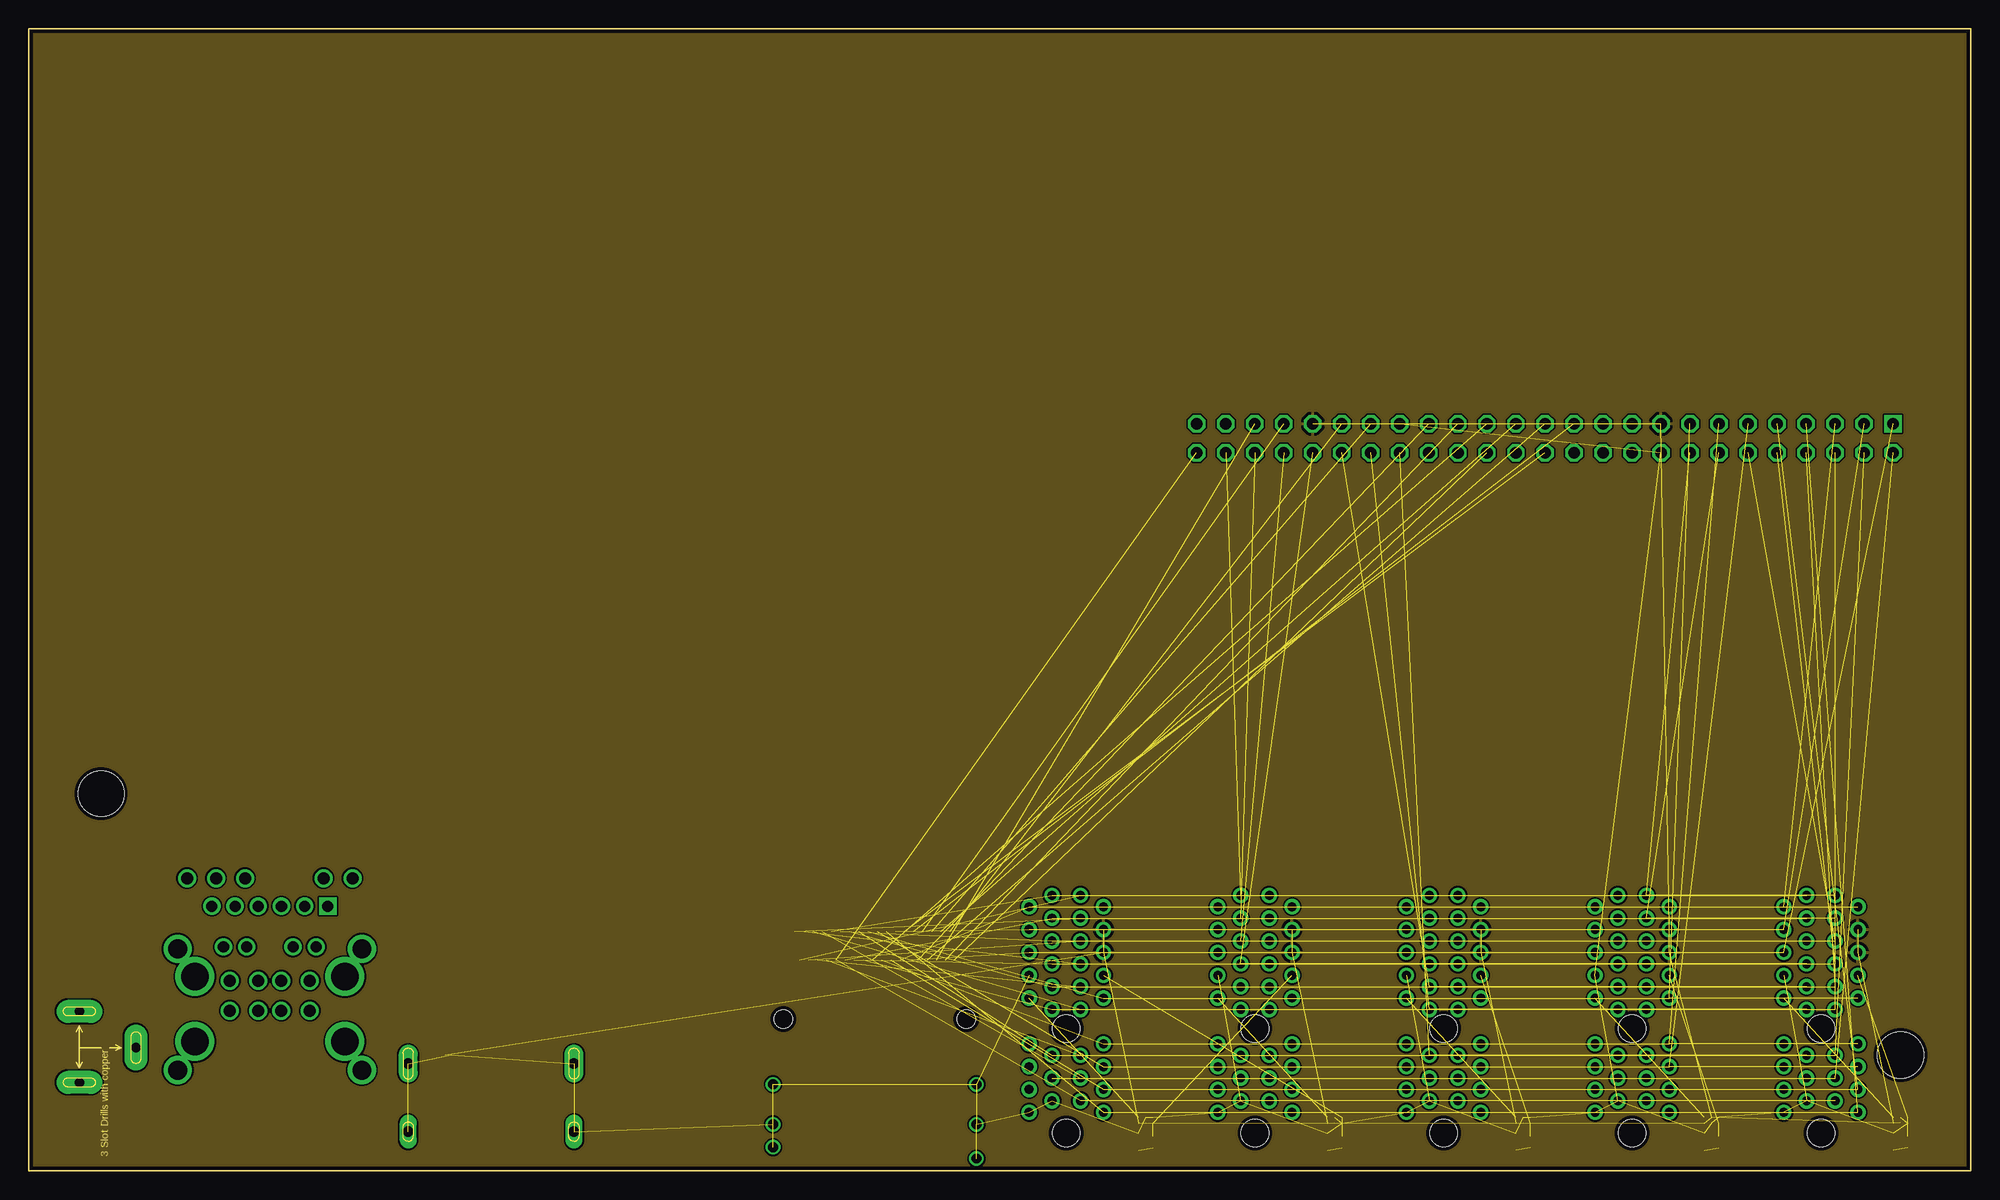
[diagram p15: board, inner layer Route15]
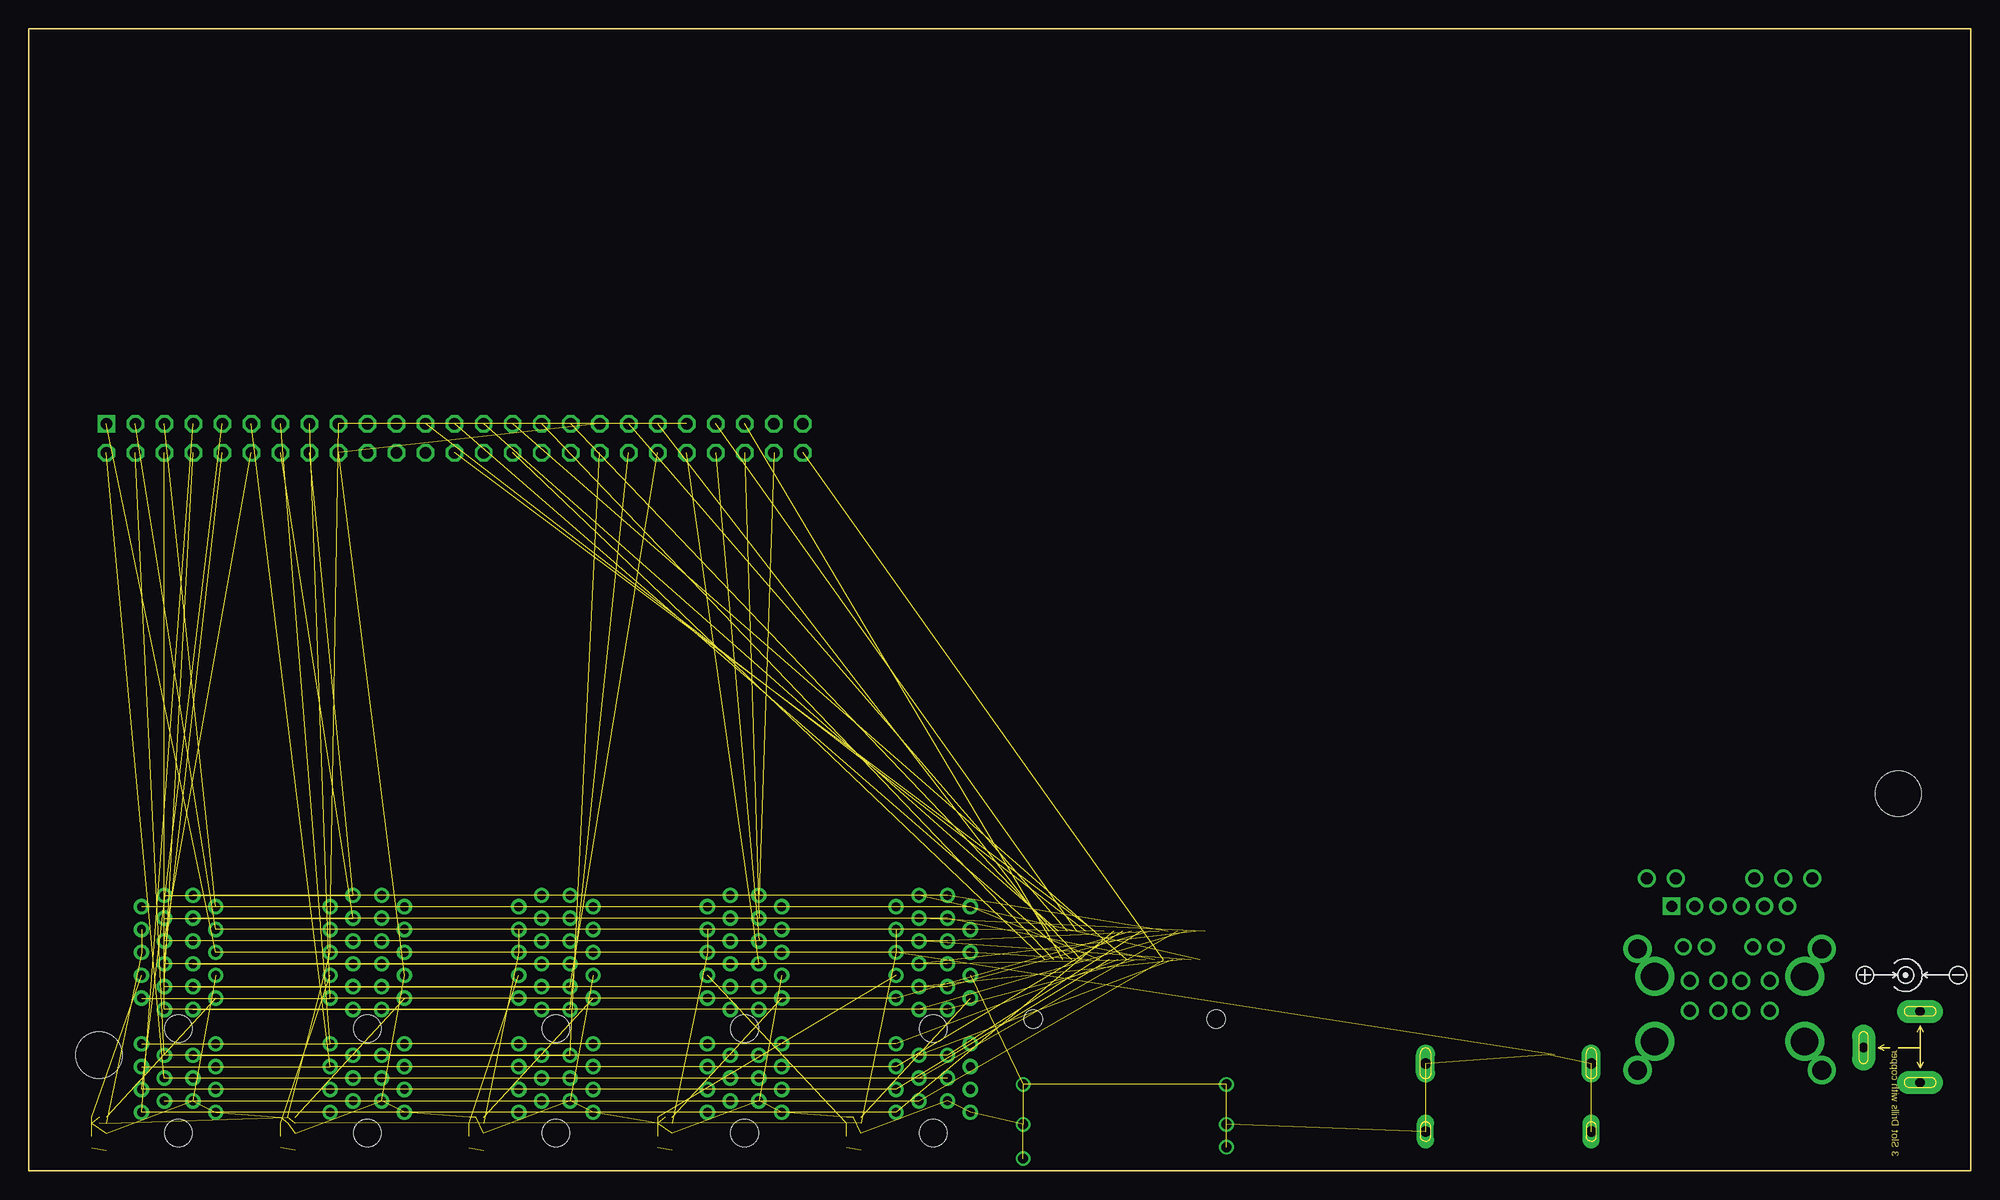
[diagram p16: board, bottom side, seen from below]

Size 170 x 100 mm. Coordinates in mm from the lower left corner, seen from the top.
Outline: 0,100 170,100 170,0 0,0 0,100
Copper layers (1+2*15+16): Top 0.035mm / dielectric 0.2mm / Route2 0.017mm / dielectric 1.2mm / Route15 0.017mm / dielectric 0.2mm / Bottom 0.035mm
Design rules "seed-4layer-6.6": minimum track width 6mil, minimum drill 0.3mm, track to track 6mil, track to pad 6mil, pad to pad 6mil, via to via 6mil, smd to smd 0mil, copper to edge 12mil, drill to drill 12mil, minimum pad ring 6mil, minimum via ring 5.5mil, stop-mask expansion 4mil, vias tented up to drill 25mil, thermal gap 10mil
Holes 4.06 mm at 163.83,10.16
Holes 4 mm at 6.35,33.02

### Footprints (pad centres in the part's own frame; a part is rotated, then mirrored left to right if it is on the bottom)
C0201 = smd 0.25 x 0.35: 1 -0.25,0; 2 0.25,0
HDMI_MOLEX_47151-0001 = smd 0.3 x 2.6: 1 4.5,0; 2 4,0; 3 3.5,0; 4 3,0; 5 2.5,0; 6 2,0; 7 1.5,0; 8 1,0; 9 0.5,0; 10 0,0; 11 -0.5,0; 12 -1,0; 13 -1.5,0; 14 -2,0; 15 -2.5,0; 16 -3,0; 17 -3.5,0; 18 -4,0; 19 -4.5,0 | drill 0.9 pad 1.65 long: P$1 -7.25,-0.76; P$2 7.25,-0.76 | drill 0.9 pad 1.5 long: P$3 7.25,-6.72; P$4 -7.25,-6.72
BGA448C80P22X22_1800X1800X127 = smd 0.37 x 0.37: A1 -8.4,8.4; A2 -7.6,8.4; A3 -6.8,8.4; A4 -6,8.4; A5 -5.2,8.4; A6 -4.4,8.4; A7 -3.6,8.4; A8 -2.8,8.4; A9 -2,8.4; A10 -1.2,8.4; A11 -0.4,8.4; A12 0.4,8.4; A13 1.2,8.4; A14 2,8.4; A15 2.8,8.4; A16 3.6,8.4; A17 4.4,8.4; A18 5.2,8.4; A19 6,8.4; A20 6.8,8.4; A21 7.6,8.4; A22 8.4,8.4; AA1 -8.4,-7.6; AA2 -7.6,-7.6; AA3 -6.8,-7.6; AA4 -6,-7.6; AA5 -5.2,-7.6; AA6 -4.4,-7.6; AA7 -3.6,-7.6; AA8 -2.8,-7.6; AA9 -2,-7.6; AA10 -1.2,-7.6; AA11 -0.4,-7.6; AA12 0.4,-7.6; AA13 1.2,-7.6; AA14 2,-7.6; AA15 2.8,-7.6; AA16 3.6,-7.6; AA17 4.4,-7.6; AA18 5.2,-7.6; AA19 6,-7.6; AA20 6.8,-7.6; AA21 7.6,-7.6; AA22 8.4,-7.6; AB1 -8.4,-8.4; AB2 -7.6,-8.4; AB3 -6.8,-8.4; AB4 -6,-8.4; AB5 -5.2,-8.4; AB6 -4.4,-8.4; AB7 -3.6,-8.4; AB8 -2.8,-8.4; AB9 -2,-8.4; AB10 -1.2,-8.4; AB11 -0.4,-8.4; AB12 0.4,-8.4; AB13 1.2,-8.4; AB14 2,-8.4; AB15 2.8,-8.4; AB16 3.6,-8.4; AB17 4.4,-8.4; AB18 5.2,-8.4; AB19 6,-8.4; AB20 6.8,-8.4; AB21 7.6,-8.4; AB22 8.4,-8.4; B1 -8.4,7.6; B2 -7.6,7.6; B3 -6.8,7.6; B4 -6,7.6; B5 -5.2,7.6; B6 -4.4,7.6; B7 -3.6,7.6; B8 -2.8,7.6; B9 -2,7.6; B10 -1.2,7.6; B11 -0.4,7.6; B12 0.4,7.6; B13 1.2,7.6; B14 2,7.6; B15 2.8,7.6; B16 3.6,7.6; B17 4.4,7.6; B18 5.2,7.6; B19 6,7.6; B20 6.8,7.6; B21 7.6,7.6; B22 8.4,7.6; C1 -8.4,6.8; C2 -7.6,6.8; C3 -6.8,6.8; C4 -6,6.8; C5 -5.2,6.8; C6 -4.4,6.8; C7 -3.6,6.8; C8 -2.8,6.8; C9 -2,6.8; C10 -1.2,6.8; C11 -0.4,6.8; C12 0.4,6.8; C13 1.2,6.8; C14 2,6.8; C15 2.8,6.8; C16 3.6,6.8; C17 4.4,6.8; C18 5.2,6.8; C19 6,6.8; C20 6.8,6.8; C21 7.6,6.8; C22 8.4,6.8; D1 -8.4,6; D2 -7.6,6; D3 -6.8,6; D4 -6,6; D5 -5.2,6; D6 -4.4,6; D7 -3.6,6; D8 -2.8,6; D9 -2,6; D10 -1.2,6; D11 -0.4,6; D12 0.4,6; D13 1.2,6; D14 2,6; D15 2.8,6; D16 3.6,6; D17 4.4,6; D18 5.2,6; D19 6,6; D20 6.8,6; D21 7.6,6; D22 8.4,6; E1 -8.4,5.2; E2 -7.6,5.2; E3 -6.8,5.2; E4 -6,5.2; E5 -5.2,5.2; E6 -4.4,5.2; E7 -3.6,5.2; E8 -2.8,5.2; E9 -2,5.2; E10 -1.2,5.2; E11 -0.4,5.2; E12 0.4,5.2; E13 1.2,5.2; E14 2,5.2; E15 2.8,5.2; E16 3.6,5.2; E17 4.4,5.2; E18 5.2,5.2; E19 6,5.2; E20 6.8,5.2; E21 7.6,5.2; E22 8.4,5.2; F1 -8.4,4.4; F2 -7.6,4.4; F3 -6.8,4.4; F4 -6,4.4; F5 -5.2,4.4; F6 -4.4,4.4; F7 -3.6,4.4; F8 -2.8,4.4; F9 -2,4.4; F10 -1.2,4.4; F11 -0.4,4.4; F12 0.4,4.4; F13 1.2,4.4; F14 2,4.4; F15 2.8,4.4; F16 3.6,4.4; F17 4.4,4.4; F18 5.2,4.4; F19 6,4.4; F20 6.8,4.4; F21 7.6,4.4; G1 -8.4,3.6; G2 -7.6,3.6; G3 -6.8,3.6; G4 -6,3.6; G5 -5.2,3.6; G6 -4.4,3.6; G8 -2.8,3.6; G10 -1.2,3.6; G12 0.4,3.6; G14 2,3.6; G16 3.6,3.6; G17 4.4,3.6; G18 5.2,3.6; G19 6,3.6; G20 6.8,3.6; G21 7.6,3.6; G22 8.4,3.6; H1 -8.4,2.8; H2 -7.6,2.8; H3 -6.8,2.8; H4 -6,2.8; H5 -5.2,2.8; H6 -4.4,2.8; H7 -3.6,2.8; H9 -2,2.8; H11 -0.4,2.8; H13 1.2,2.8; H15 2.8,2.8; H17 4.4,2.8; H18 5.2,2.8; H19 6,2.8; H20 6.8,2.8; H21 7.6,2.8; H22 8.4,2.8; J1 -8.4,2; J2 -7.6,2; J3 -6.8,2; J4 -6,2; J5 -5.2,2; J6 -4.4,2; J8 -2.8,2; J9 -2,2; J10 -1.2,2; J11 -0.4,2; J12 0.4,2; J13 1.2,2; J14 2,2; J16 3.6,2; J17 4.4,2; J18 5.2,2; J19 6,2; J20 6.8,2; J21 7.6,2; K1 -8.4,1.2; K2 -7.6,1.2; K3 -6.8,1.2; K4 -6,1.2; K5 -5.2,1.2; K6 -4.4,1.2; K7 -3.6,1.2; K9 -2,1.2; K10 -1.2,1.2; K11 -0.4,1.2; K12 0.4,1.2; K13 1.2,1.2; K14 2,1.2; K15 2.8,1.2; K17 4.4,1.2; K18 5.2,1.2; K19 6,1.2; K20 6.8,1.2; K21 7.6,1.2; K22 8.4,1.2; L1 -8.4,0.4; L2 -7.6,0.4; L3 -6.8,0.4; L4 -6,0.4; L5 -5.2,0.4; L6 -4.4,0.4; L8 -2.8,0.4; L9 -2,0.4; L10 -1.2,0.4; L11 -0.4,0.4; L12 0.4,0.4; L13 1.2,0.4; L14 2,0.4; L16 3.6,0.4; L17 4.4,0.4; L18 5.2,0.4; L19 6,0.4; L20 6.8,0.4; L21 7.6,0.4; L22 8.4,0.4; M1 -8.4,-0.4; M2 -7.6,-0.4; M3 -6.8,-0.4; M4 -6,-0.4; M5 -5.2,-0.4; M6 -4.4,-0.4; M7 -3.6,-0.4; M9 -2,-0.4; M10 -1.2,-0.4; M11 -0.4,-0.4; M12 0.4,-0.4; M13 1.2,-0.4; M14 2,-0.4; M15 2.8,-0.4; M17 4.4,-0.4; M18 5.2,-0.4; M19 6,-0.4; M20 6.8,-0.4; M21 7.6,-0.4; M22 8.4,-0.4; N1 -8.4,-1.2; N2 -7.6,-1.2; N3 -6.8,-1.2; N4 -6,-1.2; N5 -5.2,-1.2; N6 -4.4,-1.2; N8 -2.8,-1.2; N9 -2,-1.2; N10 -1.2,-1.2; N11 -0.4,-1.2; N12 0.4,-1.2; N13 1.2,-1.2; N14 2,-1.2; N16 3.6,-1.2; N17 4.4,-1.2; N18 5.2,-1.2; N19 6,-1.2; N20 6.8,-1.2; N21 7.6,-1.2; N22 8.4,-1.2; P1 -8.4,-2; P2 -7.6,-2; P3 -6.8,-2; P4 -6,-2; P5 -5.2,-2; P6 -4.4,-2; P7 -3.6,-2; P9 -2,-2; P10 -1.2,-2; P11 -0.4,-2; P12 0.4,-2; P13 1.2,-2; P14 2,-2; P15 2.8,-2; P17 4.4,-2; P18 5.2,-2; P19 6,-2; P20 6.8,-2; P21 7.6,-2; R1 -8.4,-2.8; R2 -7.6,-2.8; R3 -6.8,-2.8; R4 -6,-2.8; R5 -5.2,-2.8; R6 -4.4,-2.8; R8 -2.8,-2.8; R10 -1.2,-2.8; R12 0.4,-2.8; R14 2,-2.8; R16 3.6,-2.8; R17 4.4,-2.8; R18 5.2,-2.8; R19 6,-2.8; R20 6.8,-2.8; R21 7.6,-2.8; R22 8.4,-2.8; T1 -8.4,-3.6; T2 -7.6,-3.6; T3 -6.8,-3.6; T4 -6,-3.6; T5 -5.2,-3.6; T6 -4.4,-3.6; T7 -3.6,-3.6; T9 -2,-3.6; T11 -0.4,-3.6; T13 1.2,-3.6; T15 2.8,-3.6; T17 4.4,-3.6; T18 5.2,-3.6; T19 6,-3.6; T20 6.8,-3.6; T21 7.6,-3.6; T22 8.4,-3.6; U1 -8.4,-4.4; U2 -7.6,-4.4; U3 -6.8,-4.4; U4 -6,-4.4; U5 -5.2,-4.4; U6 -4.4,-4.4; U7 -3.6,-4.4; U8 -2.8,-4.4; U9 -2,-4.4; U10 -1.2,-4.4; U11 -0.4,-4.4; U12 0.4,-4.4; U13 1.2,-4.4; U14 2,-4.4; U15 2.8,-4.4; U16 3.6,-4.4; U17 4.4,-4.4; U18 5.2,-4.4; U19 6,-4.4; U20 6.8,-4.4; U21 7.6,-4.4; V1 -8.4,-5.2; V2 -7.6,-5.2; V3 -6.8,-5.2; V4 -6,-5.2; V5 -5.2,-5.2; V6 -4.4,-5.2; V7 -3.6,-5.2; V8 -2.8,-5.2; V9 -2,-5.2; V10 -1.2,-5.2; V11 -0.4,-5.2; V12 0.4,-5.2; V13 1.2,-5.2; V14 2,-5.2; V15 2.8,-5.2; V16 3.6,-5.2; V17 4.4,-5.2; V18 5.2,-5.2; V19 6,-5.2; V20 6.8,-5.2; V21 7.6,-5.2; V22 8.4,-5.2; W1 -8.4,-6; W2 -7.6,-6; W3 -6.8,-6; W4 -6,-6; W5 -5.2,-6; W6 -4.4,-6; W7 -3.6,-6; W8 -2.8,-6; W9 -2,-6; W10 -1.2,-6; W11 -0.4,-6; W12 0.4,-6; W13 1.2,-6; W14 2,-6; W15 2.8,-6; W16 3.6,-6; W17 4.4,-6; W18 5.2,-6; W19 6,-6; W20 6.8,-6; W21 7.6,-6; W22 8.4,-6; Y1 -8.4,-6.8; Y2 -7.6,-6.8; Y3 -6.8,-6.8; Y4 -6,-6.8; Y5 -5.2,-6.8; Y6 -4.4,-6.8; Y7 -3.6,-6.8; Y8 -2.8,-6.8; Y9 -2,-6.8; Y10 -1.2,-6.8; Y11 -0.4,-6.8; Y12 0.4,-6.8; Y13 1.2,-6.8; Y14 2,-6.8; Y15 2.8,-6.8; Y16 3.6,-6.8; Y17 4.4,-6.8; Y18 5.2,-6.8; Y19 6,-6.8; Y20 6.8,-6.8; Y21 7.6,-6.8; Y22 8.4,-6.8
BGA96C80P9X16_900X1300X120 = smd 0.41 x 0.41: A1 -3.2,6; A2 -2.4,6; A3 -1.6,6; A7 1.6,6; A8 2.4,6; A9 3.2,6; B1 -3.2,5.2; B2 -2.4,5.2; B3 -1.6,5.2; B7 1.6,5.2; B8 2.4,5.2; B9 3.2,5.2; C1 -3.2,4.4; C2 -2.4,4.4; C3 -1.6,4.4; C7 1.6,4.4; C8 2.4,4.4; C9 3.2,4.4; D1 -3.2,3.6; D2 -2.4,3.6; D3 -1.6,3.6; D7 1.6,3.6; D8 2.4,3.6; D9 3.2,3.6; E1 -3.2,2.8; E2 -2.4,2.8; E3 -1.6,2.8; E7 1.6,2.8; E8 2.4,2.8; E9 3.2,2.8; F1 -3.2,2; F2 -2.4,2; F3 -1.6,2; F7 1.6,2; F8 2.4,2; F9 3.2,2; G1 -3.2,1.2; G2 -2.4,1.2; G3 -1.6,1.2; G7 1.6,1.2; G8 2.4,1.2; G9 3.2,1.2; H1 -3.2,0.4; H2 -2.4,0.4; H3 -1.6,0.4; H7 1.6,0.4; H8 2.4,0.4; H9 3.2,0.4; J1 -3.2,-0.4; J2 -2.4,-0.4; J3 -1.6,-0.4; J7 1.6,-0.4; J8 2.4,-0.4; J9 3.2,-0.4; K1 -3.2,-1.2; K2 -2.4,-1.2; K3 -1.6,-1.2; K7 1.6,-1.2; K8 2.4,-1.2; K9 3.2,-1.2; L1 -3.2,-2; L2 -2.4,-2; L3 -1.6,-2; L7 1.6,-2; L8 2.4,-2; L9 3.2,-2; M1 -3.2,-2.8; M2 -2.4,-2.8; M3 -1.6,-2.8; M7 1.6,-2.8; M8 2.4,-2.8; M9 3.2,-2.8; N1 -3.2,-3.6; N2 -2.4,-3.6; N3 -1.6,-3.6; N7 1.6,-3.6; N8 2.4,-3.6; N9 3.2,-3.6; P1 -3.2,-4.4; P2 -2.4,-4.4; P3 -1.6,-4.4; P7 1.6,-4.4; P8 2.4,-4.4; P9 3.2,-4.4; R1 -3.2,-5.2; R2 -2.4,-5.2; R3 -1.6,-5.2; R7 1.6,-5.2; R8 2.4,-5.2; R9 3.2,-5.2; T1 -3.2,-6; T2 -2.4,-6; T3 -1.6,-6; T7 1.6,-6; T8 2.4,-6; T9 3.2,-6
QFP50P1200X1200X120-65N = smd 1.475 x 0.3: 1 -5.738,3.75; 2 -5.738,3.25; 3 -5.738,2.75; 4 -5.738,2.25; 5 -5.738,1.75; 6 -5.738,1.25; 7 -5.738,0.75; 8 -5.738,0.25; 9 -5.738,-0.25; 10 -5.738,-0.75; 11 -5.738,-1.25; 12 -5.738,-1.75; 13 -5.738,-2.25; 14 -5.738,-2.75; 15 -5.738,-3.25; 16 -5.738,-3.75; 33 5.738,-3.75; 34 5.738,-3.25; 35 5.738,-2.75; 36 5.738,-2.25; 37 5.738,-1.75; 38 5.738,-1.25; 39 5.738,-0.75; 40 5.738,-0.25; 41 5.738,0.25; 42 5.738,0.75; 43 5.738,1.25; 44 5.738,1.75; 45 5.738,2.25; 46 5.738,2.75; 47 5.738,3.25; 48 5.738,3.75 | smd 0.3 x 1.475: 17 -3.75,-5.738; 18 -3.25,-5.738; 19 -2.75,-5.738; 20 -2.25,-5.738; 21 -1.75,-5.738; 22 -1.25,-5.738; 23 -0.75,-5.738; 24 -0.25,-5.738; 25 0.25,-5.738; 26 0.75,-5.738; 27 1.25,-5.738; 28 1.75,-5.738; 29 2.25,-5.738; 30 2.75,-5.738; 31 3.25,-5.738; 32 3.75,-5.738; 49 3.75,5.738; 50 3.25,5.738; 51 2.75,5.738; 52 2.25,5.738; 53 1.75,5.738; 54 1.25,5.738; 55 0.75,5.738; 56 0.25,5.738; 57 -0.25,5.738; 58 -0.75,5.738; 59 -1.25,5.738; 60 -1.75,5.738; 61 -2.25,5.738; 62 -2.75,5.738; 63 -3.25,5.738; 64 -3.75,5.738 | smd 5 x 5: 65 0,0
QFN40P500X600X80-45N = smd 0.85 x 0.2: 1 -2.45,2.2; 2 -2.45,1.8; 3 -2.45,1.4; 4 -2.45,1; 5 -2.45,0.6; 6 -2.45,0.2; 7 -2.45,-0.2; 8 -2.45,-0.6; 9 -2.45,-1; 10 -2.45,-1.4; 11 -2.45,-1.8; 12 -2.45,-2.2; 23 2.45,-2.2; 24 2.45,-1.8; 25 2.45,-1.4; 26 2.45,-1; 27 2.45,-0.6; 28 2.45,-0.2; 29 2.45,0.2; 30 2.45,0.6; 31 2.45,1; 32 2.45,1.4; 33 2.45,1.8; 34 2.45,2.2 | smd 0.2 x 0.85: 13 -1.8,-2.95; 14 -1.4,-2.95; 15 -1,-2.95; 16 -0.6,-2.95; 17 -0.2,-2.95; 18 0.2,-2.95; 19 0.6,-2.95; 20 1,-2.95; 21 1.4,-2.95; 22 1.8,-2.95; 35 1.8,2.95; 36 1.4,2.95; 37 1,2.95; 38 0.6,2.95; 39 0.2,2.95; 40 -0.2,2.95; 41 -0.6,2.95; 42 -1,2.95; 43 -1.4,2.95; 44 -1.8,2.95 | smd 3.6 x 4.6: 45 0,0
DCJ3P-14.2X11.0X9.0MM = drill 0.813 pad 2.032 long: + 3.175,0; -1 -3.048,0; -2 0,-4.953
5025700893 = smd 1.5 x 1.15: DTCT -0.6,-7.375; GND1 6.15,-7.375; GND3 -2.9,-7.375 | smd 1.4 x 1.7: GND0 6.45,7.1; GND2 -6.45,7.1 | smd 1.15 x 1.5: GND4 6.575,-2.65 | smd 0.8 x 1.5: P$1 -2.7,4.2; P$2 -1.6,4.2; P$3 -0.5,4.2; P$4 0.6,4.2; P$5 1.7,4.2; P$6 2.8,4.2; P$7 3.9,4.2; P$8 5,4.2
RJMG2310228A0ER = drill 0.97 pad 1.509 square: 1 0,0 | drill 0.97 pad 1.509: 2 -2.03,0; 3 -4.06,0; 4 -6.09,0; 5 -8.12,0; 6 -10.15,0; 7 -1.015,-3.55; 8 -3.045,-3.55; 9 -7.105,-3.55; 10 -9.135,-3.55 | drill 1.05 pad 1.575: 11 2.165,2.44; 12 -0.375,2.44; 13 -7.235,2.44; 14 -9.775,2.44; 15 -12.315,2.44; U11 -1.575,-9.14; U12 -4.075,-9.14; U13 -6.075,-9.14; U14 -8.575,-9.14; U21 -1.575,-6.52; U22 -4.075,-6.52; U23 -6.075,-6.52; U24 -8.575,-6.52 | drill 2.39 pad 3.3: MH1 -11.64,-6.15; MH2 -11.64,-11.84; MH3 1.49,-11.84; MH4 1.49,-6.15 | drill 1.65 pad 2.3: MH5 -13.14,-3.73; MH6 -13.14,-14.35; MH7 2.99,-14.35; MH8 2.99,-3.73
CHIPLED_0603 = smd 0.8 x 0.8: A 0,-0.75; C 0,0.75
R0201 = smd 0.28 x 0.43: 1 -0.255,0; 2 0.255,0
R0402 = smd 0.6 x 0.7: 1 -0.5,0; 2 0.5,0
1001878410210TLF = drill 0.78 pad 1.337: A1 0,0; A2 1,2; A3 2,0; A4 3,2; A5 4,0; A6 5,2; A7 6,0; A8 7,2; A9 8,0; A10 9,2; A11 10,0; A12 13,2; A13 14,0; A14 15,2; A15 16,0; A16 17,2; A17 18,0; A18 19,2; B1 0,-2.5; B2 1,-4.5; B3 2,-2.5; B4 3,-4.5; B5 4,-2.5; B6 5,-4.5; B7 6,-2.5; B8 7,-4.5; B9 8,-2.5; B10 9,-4.5; B11 10,-2.5; B12 13,-4.5; B13 14,-2.5; B14 15,-4.5; B15 16,-2.5; B16 17,-4.5; B17 18,-2.5; B18 19,-4.5 | hole 2.4: 11.65,-1.25; 20.8,-1.25
2X25 = drill 1.016 square: 1 -1.27,30.48 | drill 1.016 octagon: 2 1.27,30.48; 3 -1.27,27.94; 4 1.27,27.94; 5 -1.27,25.4; 6 1.27,25.4; 7 -1.27,22.86; 8 1.27,22.86; 9 -1.27,20.32; 10 1.27,20.32; 11 -1.27,17.78; 12 1.27,17.78; 13 -1.27,15.24; 14 1.27,15.24; 15 -1.27,12.7; 16 1.27,12.7; 17 -1.27,10.16; 18 1.27,10.16; 19 -1.27,7.62; 20 1.27,7.62; 21 -1.27,5.08; 22 1.27,5.08; 23 -1.27,2.54; 24 1.27,2.54; 25 -1.27,0; 26 1.27,0; 27 -1.27,-2.54; 28 1.27,-2.54; 29 -1.27,-5.08; 30 1.27,-5.08; 31 -1.27,-7.62; 32 1.27,-7.62; 33 -1.27,-10.16; 34 1.27,-10.16; 35 -1.27,-12.7; 36 1.27,-12.7; 37 -1.27,-15.24; 38 1.27,-15.24; 39 -1.27,-17.78; 40 1.27,-17.78; 41 -1.27,-20.32; 42 1.27,-20.32; 43 -1.27,-22.86; 44 1.27,-22.86; 45 -1.27,-25.4; 46 1.27,-25.4; 47 -1.27,-27.94; 48 1.27,-27.94; 49 -1.27,-30.48; 50 1.27,-30.48
MINI-SAS = smd 0.35 x 1.8: PA1 -6.2,8.78; PA2 -5.4,8.78; PA3 -4.6,8.78; PA4 -3.8,8.78; PA5 -3,8.78; PA6 -2.2,8.78; PA7 -1.4,8.78; PA8 -0.6,8.78; PA9 0.2,8.78; PA10 1,8.78; PA11 1.8,8.78; PA12 2.6,8.78; PA13 3.4,8.78; PA14 4.2,8.78; PA15 5,8.78; PA16 5.8,8.78; PA17 6.6,8.78; PA18 7.4,8.78; PB1 -6.6,11.29; PB2 -5.8,11.29; PB3 -5,11.29; PB4 -4.2,11.29; PB5 -3.4,11.29; PB6 -2.6,11.29; PB7 -1.8,11.29; PB8 -1,11.29; PB9 -0.2,11.29; PB10 0.6,11.29; PB11 1.4,11.29; PB12 2.2,11.29; PB13 3,11.29; PB14 3.8,11.29; PB15 4.6,11.29; PB16 5.4,11.29; PB17 6.2,11.29; PB18 7,11.29 | drill 0.85: SHIELD1 -8.5,-2.12; SHIELD2 -8.5,-5.62; SHIELD3 -8.5,-7.62; SHIELD4 9.3,-2.12; SHIELD5 9.3,-5.62; SHIELD6 9.3,-8.62 | hole 1.6: -7.6,3.6; 8.4,3.6

### Placement (x,y rotation side)
C1  114.3,4.45 90 top
C53  97.79,4.45 90 top
C55  130.81,4.45 90 top
C56  147.32,4.45 90 top
C81  163.83,4.45 90 top
CN1  40.48,10.16 0 top
IC1  41.59,54.1 0 top
IC2  18.53,53.56 90 top
IC3  40.89,26.24 0 top
IC4  6,25 0 top
J1  4.45,10.79 90 top
J2  56.52,8.26 0 top
J3  26.19,23.18 0 top
LD0  97.16,2.54 0 top
LD1  113.67,2.54 0 top
LD2  130.18,2.54 0 top
LD3  146.69,2.54 0 top
LD4  163.19,2.54 0 top
R1  163.19,4.45 90 top
R2  146.69,4.45 90 top
R3  130.18,4.45 90 top
R4  113.67,4.45 90 top
R5  97.16,4.45 90 top
R27  98.42,2.54 270 top
R61  98.42,4.45 90 top
R62  114.94,4.45 270 top
R63  131.44,4.45 90 top
R64  147.96,4.45 90 top
R65  164.47,4.45 270 top
R98  114.94,2.54 270 top
R101  131.44,2.54 270 top
R104  147.96,2.54 270 top
R107  164.47,2.54 270 top
SLOT0  92.08,24.13 270 top
SLOT1  108.58,24.13 270 top
SLOT2  125.09,24.13 270 top
SLOT3  141.6,24.13 270 top
SLOT4  158.12,24.13 270 top
U$1  132.72,64.14 270 top
U$3  73.66,9.7 0 top

### Tracks (layer width: path | path; a pad name or v marks a point on that pad's centre or on a via)
!CCTL!  (1 unrouted)
!EXTSEL!  (1 unrouted)
!HALT!  (1 unrouted)
!IRQ!  (1 unrouted)
!MPD!  (1 unrouted)
!RST!  (1 unrouted)
!S4!  (1 unrouted)
!S5!  (1 unrouted)
!SP1_IRQ!  (1 unrouted)
!SPI0_IRQ!  (1 unrouted)
!SPI2_IRQ!  (1 unrouted)
!SPI3_IRQ!  (1 unrouted)
!SPI4_IRQ!  (1 unrouted)
+3V3  (4 unrouted)
+5V  (22 unrouted)
  pour Route15: -2.54,102.87 172.72,102.87 172.72,-2.54 -2.54,-2.54
A0  (6 unrouted)
A1  (6 unrouted)
A2  (6 unrouted)
A3  (6 unrouted)
A4  (6 unrouted)
A5  (6 unrouted)
A6  (6 unrouted)
A7  (6 unrouted)
A8  (6 unrouted)
A9  (6 unrouted)
A10  (6 unrouted)
A11  (6 unrouted)
A12  (6 unrouted)
A13  (6 unrouted)
A14  (6 unrouted)
A15  (6 unrouted)
AVALID  (4 unrouted)
CLK  (1 unrouted)
D0  (6 unrouted)
D1  (6 unrouted)
D2  (6 unrouted)
D3  (6 unrouted)
D4  (6 unrouted)
D5  (6 unrouted)
D6  (6 unrouted)
D7  (6 unrouted)
GND  (42 unrouted)
  pour Route2: -1.27,101.6 171.45,101.6 171.45,-1.27 -1.27,-1.27
N$1  (1 unrouted)
N$3  (1 unrouted)
N$5  (1 unrouted)
N$6  (2 unrouted)
N$7  (2 unrouted)
N$8  (1 unrouted)
N$9  (2 unrouted)
N$10  (1 unrouted)
PRESENT0  (2 unrouted)
PRESENT1  (2 unrouted)
R/!W!  (1 unrouted)
RD4  (1 unrouted)
RD5  (1 unrouted)

### Text on the board
tPlace: Should be 3.7mm / past edge
tNames: Measure holes on mini-itx board
Document: 1 : Signal / 2 : GND / 3 : Signal / 14 : +5v / signal / 15 : +3.3v / 16 : Signal
dxf: Silkscreen needs work / Space for version label